# EAGLE design PropBoard_V1.7 (EAGLE 7.6.0)
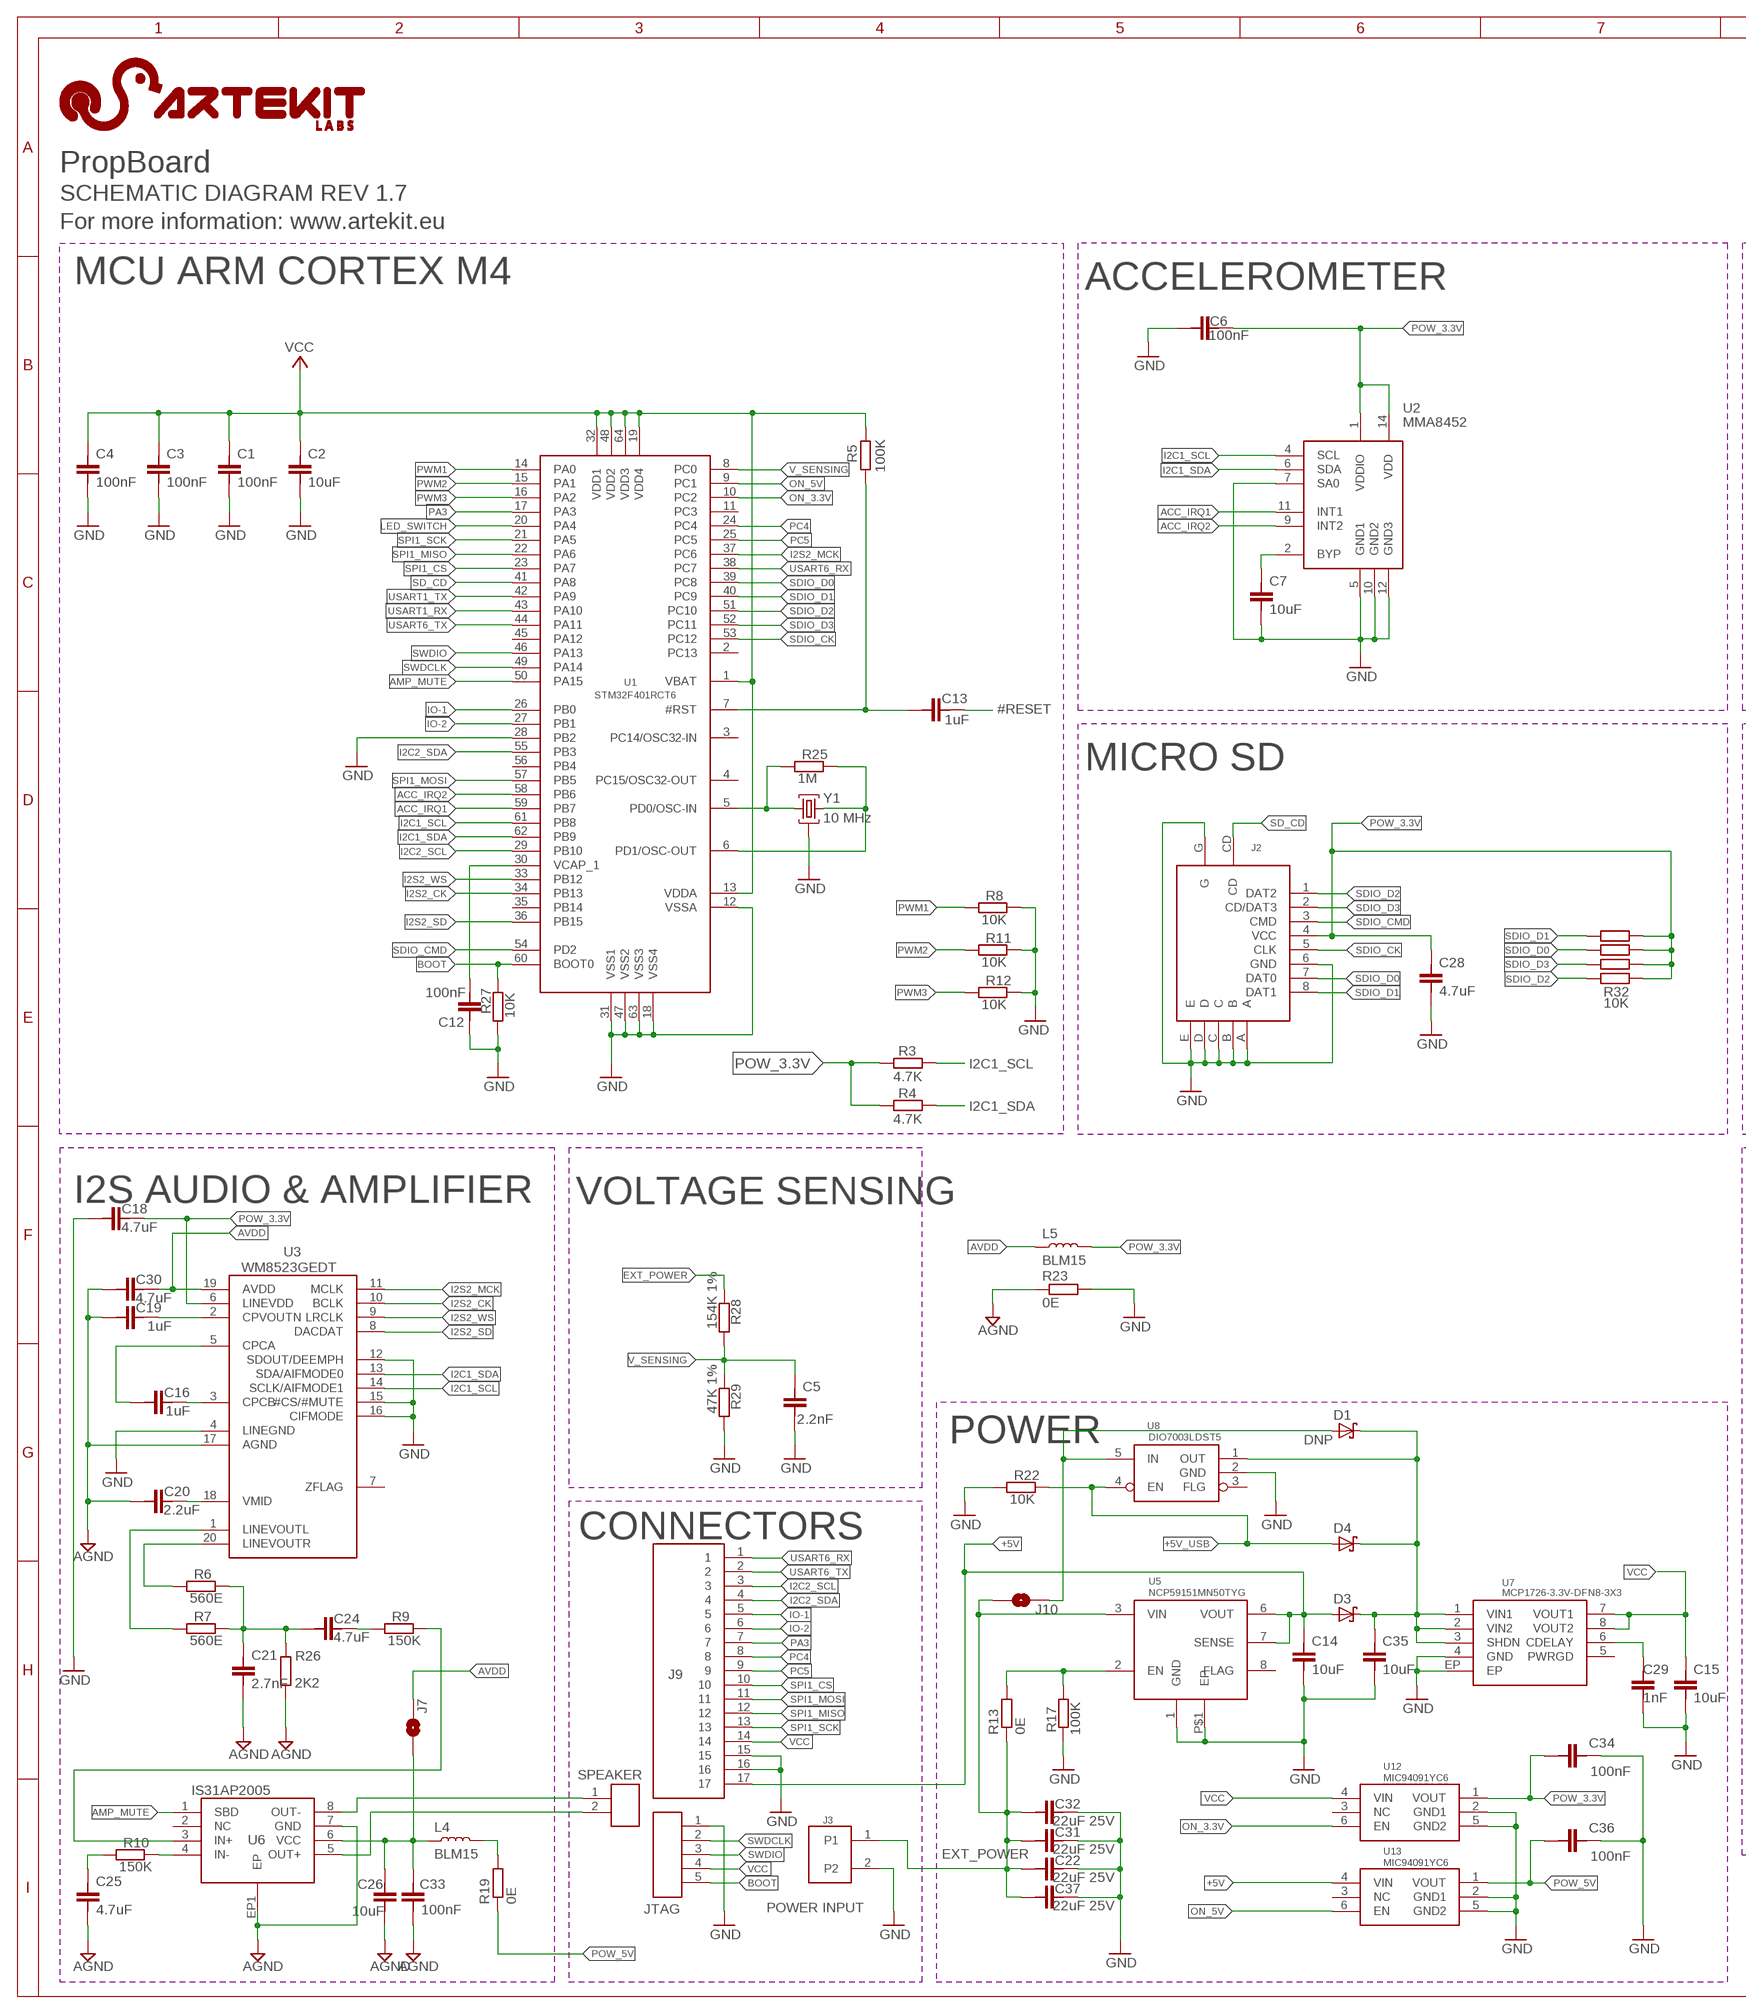
[diagram p0: schematic, sheet 1, part 1 of 2]
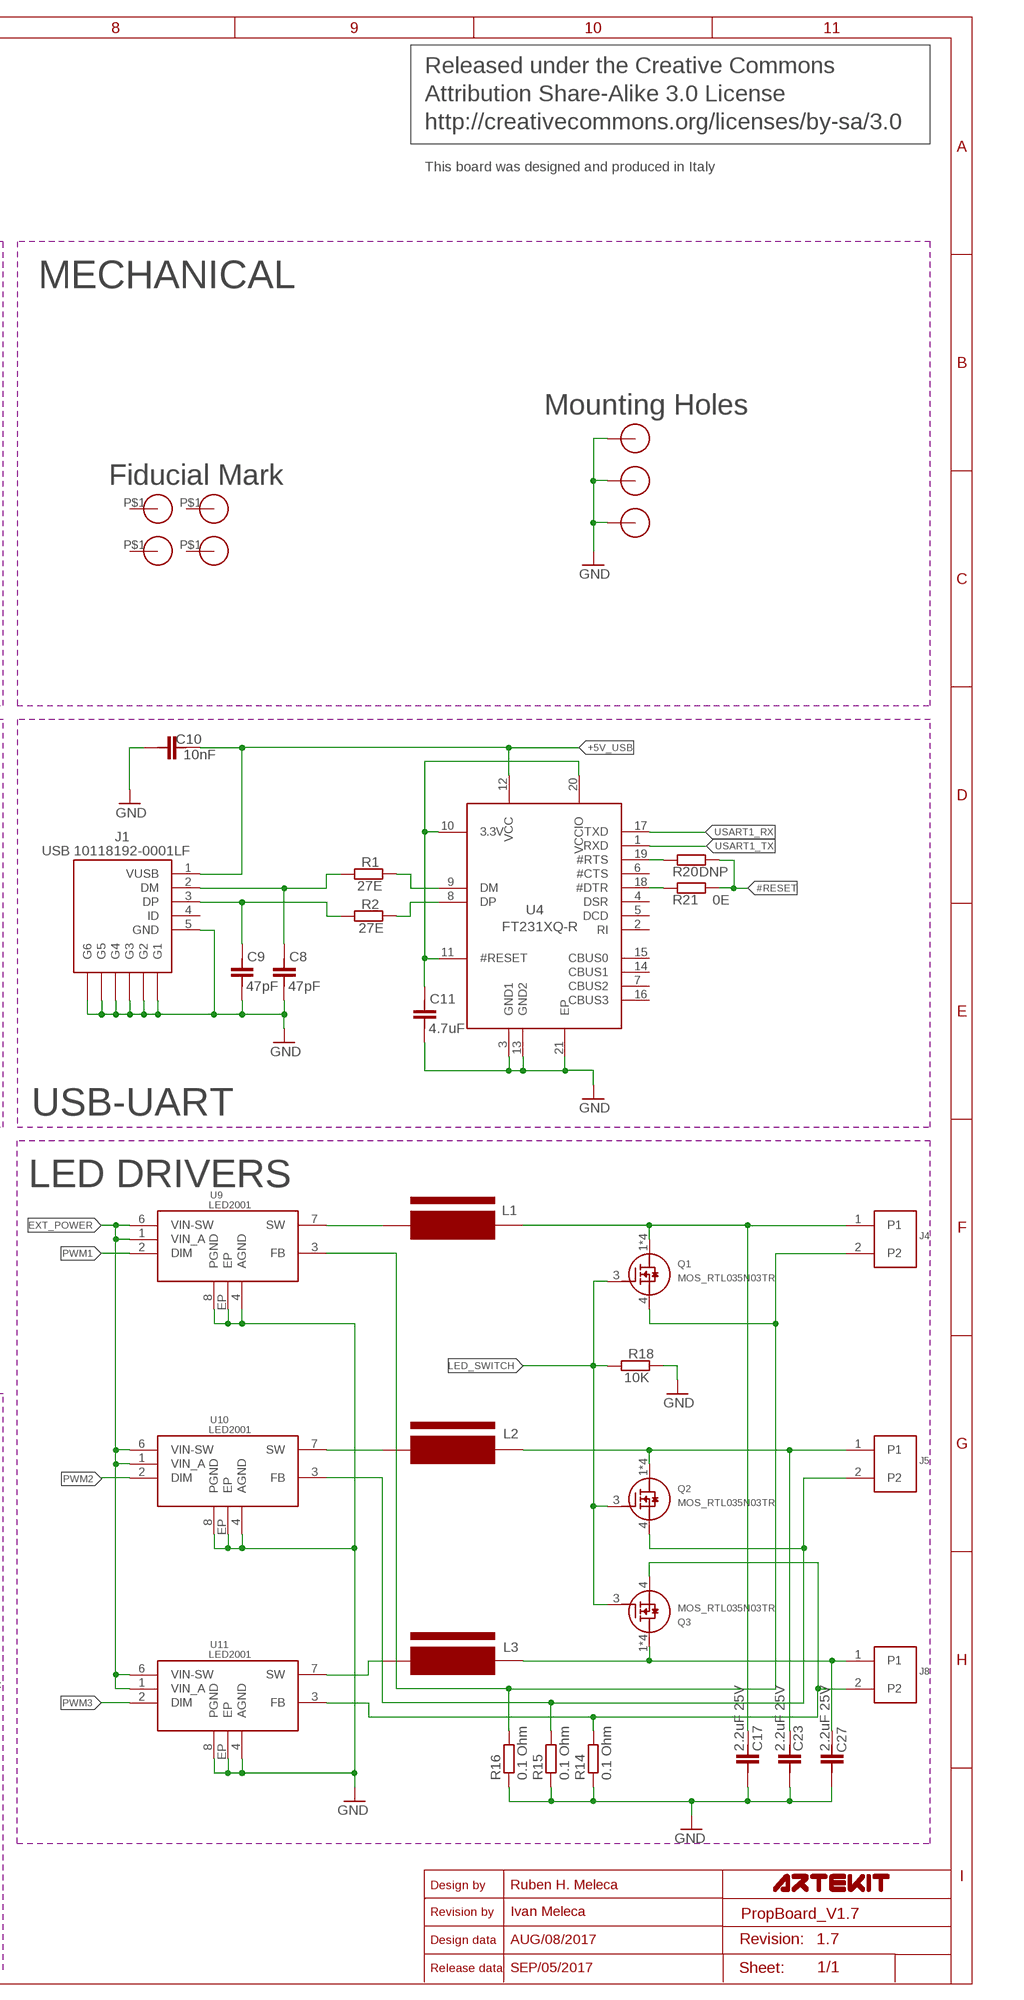
[diagram p1: schematic, sheet 1, part 2 of 2]

## Parts
C1  100nF  C0402  [C0402]
C2  10uF  C0402  [C0402]
C3  100nF  C0402  [C0402]
C4  100nF  C0402  [C0402]
C5  2.2nF  C0402  [C0402]
C6  100nF  C0402  [C0402]
C7  10uF  C0402  [C0402]
C8  47pF  C0402  [C0402]
C9  47pF  C0402  [C0402]
C10  10nF  C0402  [C0402]
C11  4.7uF  C0402  [C0402]
C12  100nF  C0402  [C0402]
C13  1uF  C0402  [C0402]
C14  10uF  C0402  [C0402]
C15  10uF  C0402  [C0402]
C16  1uF  C0402-WIDE  [C0402-WIDE]
C17  2.2uF 25V  C0603  [C0603]
C18  4.7uF  C0402  [C0402]
C19  1uF  C0402  [C0402]
C20  2.2uF  C0402  [C0402]
C21  2.7nF  C0402  [C0402]
C22  22uF 25V  C0805  [C0805]
C23  2.2uF 25V  C0603  [C0603]
C24  4.7uF  C0402  [C0402]
C25  4.7uF  C0402  [C0402]
C26  10uF  C0402  [C0402]
C27  2.2uF 25V  C0603  [C0603]
C28  4.7uF  C0402  [C0402]
C29  1nF  C0402  [C0402]
C30  4.7uF  C0402  [C0402]
C31  22uF 25V  C0805  [C0805]
C32  22uF 25V  C0805  [C0805]
C33  100nF  C0402  [C0402]
C34  100nF  C0402  [C0402]
C35  10uF  C0402  [C0402]
C36  100nF  C0402  [C0402]
C37  22uF 25V  C0805  [C0805]
D1  DNP  DIO-SCHOTTKY-10V-1A-BAT60JFILM  [SOD-323]
D3  BAT60  DIO-SCHOTTKY-10V-1A-BAT60JFILM  [SOD-323]
D4  BAT60  DIO-SCHOTTKY-10V-1A-BAT60JFILM  [SOD-323]
J1  USB 10118192-0001LF  CON-USB-MICRO-B-SMD  [CON-USB-MICRO-B-SMD]
J2  MICRO-SD-CON-MOLEX-503182-0852  [MICRO-SD-CON-MOLEX-503182-0852]
J3  PROP-POWER-PAD  [2-WAY-POWER-PAD]
J4  PROP-LED-PAD  [2-WAY-POWER-PAD-SMALL]
J5  PROP-LED-PAD  [2-WAY-POWER-PAD-SMALL]
J6  CON-PH-1X02-P0.1"2MM  [PIN-HEADER-1X02-P2MM]
J7  JUMPER-1-OPEN  [JUMPER-1-OPEN]
J8  PROP-LED-PAD  [2-WAY-POWER-PAD-SMALL]
J9  CON-PH-1X17-P0.1  [PIN-HEADER-1X17-NODASH]
J10  JUMPER-1-OPEN  [JUMPER-1-OPEN]
L1  SRN6028-3R9M  IND-MURATA-DG6050C-SERIES  [IND-MURATA-DG6050-SERIES]
L2  SRN6028-3R9M  IND-MURATA-DG6050C-SERIES  [IND-MURATA-DG6050-SERIES]
L3  SRN6028-3R9M  IND-MURATA-DG6050C-SERIES  [IND-MURATA-DG6050-SERIES]
L4  BLM15  L0402  [I0402]
L5  BLM15  L0402  [I0402]
Q1  MOS_RTL035N03TR  [SOT-363-6]
Q2  MOS_RTL035N03TR  [SOT-363-6]
Q3  MOS_RTL035N03TR  [SOT-363-6]
R1  27E  R0402  [R0402]
R2  27E  R0402  [R0402]
R3  4.7K  R0402  [R0402]
R4  4.7K  R0402  [R0402]
R5  100K  R0402  [R0402]
R6  560E  R0402  [R0402]
R7  560E  R0402  [R0402]
R8  10K  R0402  [R0402]
R9  150K  R0402  [R0402]
R10  150K  R0402  [R0402]
R11  10K  R0402  [R0402]
R12  10K  R0402  [R0402]
R13  0E  R0603  [R0603]
R14  0.1 Ohm  R0805  [R0805]
R15  0.1 Ohm  R0805  [R0805]
R16  0.1 Ohm  R0805  [R0805]
R17  100K  R0402  [R0402]
R18  10K  R0402  [R0402]
R19  0E  R0603  [R0603]
R20  DNP  R0402  [R0402]
R21  0E  R0402  [R0402]
R22  10K  R0402  [R0402]
R23  0E  R0402  [R0402]
R25  1M  R0402  [R0402]
R26  2K2  R0402  [R0402]
R27  10K  R0402  [R0402]
R28  154K 1%  R0402  [R0402]
R29  47K 1%  R0402  [R0402]
R32  10K  RESISTOR-ARRAY-X4-0603  [RES-ARRAY-0603]
U1  STM32F401RCT6  STM32F401RBT6  [LQFP64-10X10-P0.50]
U2  MMA8452  [QFN-COL-16-3X3-P0.50-MMA8452]
U3  WM8523GEDT  [TSSOP-20]
U4  FT231XQ-R  [QFN20-4X4-P0.50]
U5  NCP59151MN50TYG  [DFN8-4X4]
U6  IS31AP2005  IS31AP2005-DLS2-TR  [DFN-8-3X3MM-P0.65]
U7  MCP1726-3.3V-DFN8-3X3  [DFN8-3X3]
U8  DIO7003LDST5  [SOT23-5]
U9  LED2001  LED2001-VFQFPN8  [VFQFPN-8]
U10  LED2001  LED2001-VFQFPN8  [VFQFPN-8]
U11  LED2001  LED2001-VFQFPN8  [VFQFPN-8]
U12  MIC94091YC6  [SOT363-6]
U13  MIC94091YC6  [SOT363-6]
U$1  CON-PH-1X05-P0.1"  [PIN-HEADER-1X05-NODASH]
U$2  HOLE-2MM-METALIZED  [HOLE-2MM-METALIZED]
U$3  HOLE-2MM-METALIZED  [HOLE-2MM-METALIZED]
U$4  HOLE-2MM-METALIZED  [HOLE-2MM-METALIZED]
U$5  FIDUTIAL_1.2MM  [FIDUTIAL_1.2MM]
U$6  FIDUTIAL_1.2MM  [FIDUTIAL_1.2MM]
U$8  FIDUTIAL_1.2MM  [FIDUTIAL_1.2MM]
U$9  FIDUTIAL_1.2MM  [FIDUTIAL_1.2MM]
Y1  10 MHz  RESONATOR-MURATA-CSTCE8M00G55-R0  [RESONATOR-MURATA-CSTCE-SERIES]

## Nets
#RESET: C13.2 R20.1 R21.1
+5V: C14.1 D3.A J9.17 U5.6(VOUT) U5.7(SENSE) U13.4(VIN)
+5V_USB: C10.2 D4.A J1.1(VUSB) R22.2 U4.12(VCC) U8.4(EN)
ACC_IRQ1: U1.59(PB7) U2.11(INT1)
ACC_IRQ2: U1.58(PB6) U2.9(INT2)
AGND: C19.1 C20.1 C21.2 C25.2 C26.2 C30.1 C33.2 R23.1 R26.1 U3.17(AGND) U6.7(GND) U6.EP1(EP)
AMP_MUTE: U1.50(PA15) U6.1(SBD)
AVDD: C30.2 J7.2 L5.1 U3.19(AVDD)
BOOT: R27.2 U1.60(BOOT0) U$1.5
EXT_POWER: C22.1 C31.1 C32.1 C37.1 J3.1 J10.1 R13.1 R28.2 U5.3(VIN) U9.1(VIN_A) U9.6(VIN-SW) U10.1(VIN_A) U10.6(VIN-SW) U11.1(VIN_A) U11.6(VIN-SW)
GND: C1.2 C2.2 C3.2 C4.2 C5.2 C6.1 C7.2 C8.1 C9.1 C10.1 C11.1 C12.2 C14.2 C15.2 C17.2 C18.1 C22.2 C23.2 C27.2 C28.2 C29.2 C31.2 C32.2 C34.2 C35.2 C36.2 C37.2 J1.5(GND) J1.6(G1) J1.7(G2) J1.8(G3) J1.9(G4) J1.10(G5) J1.11(G6) J2.6(GND) J2.A J2.B J2.C J2.D J2.E J2.G J3.2 J9.15 J9.16 R8.2 R11.2 R12.2 R14.1 R15.1 R16.1 R17.2 R18.2 R22.1 R23.2 R27.1 R29.1 U1.12(VSSA) U1.18(VSS4) U1.28(PB2) U1.31(VSS1) U1.47(VSS2) U1.63(VSS3) U2.5(GND1) U2.7(SA0) U2.10(GND2) U2.12(GND3) U3.4(LINEGND) U3.12(SDOUT/DEEMPH) U3.15(#CS/#MUTE) U3.16(CIFMODE) U4.3(GND1) U4.13(GND2) U4.21(EP) U5.1(GND) U5.P$1(EP) U7.4(GND) U7.EP U8.2(GND) U9.4(AGND) U9.8(PGND) U9.EP U10.4(AGND) U10.8(PGND) U10.EP U11.4(AGND) U11.8(PGND) U11.EP U12.2(GND1) U12.5(GND2) U13.2(GND1) U13.5(GND2) U$1.1 U$2.1 U$3.1 U$4.1 Y1.2
I2C1_SCL: R3.1 U1.61(PB8) U2.4(SCL) U3.14(SCLK/AIFMODE1)
I2C1_SDA: R4.1 U1.62(PB9) U2.6(SDA) U3.13(SDA/AIFMODE0)
I2C2_SCL: J9.3 U1.29(PB10)
I2C2_SDA: J9.4 U1.55(PB3)
I2S2_CK: U1.34(PB13) U3.10(BCLK)
I2S2_MCK: U1.37(PC6) U3.11(MCLK)
I2S2_SD: U1.36(PB15) U3.8(DACDAT)
I2S2_WS: U1.33(PB12) U3.9(LRCLK)
IO-1: J9.5 U1.26(PB0)
IO-2: J9.6 U1.27(PB1)
LED_SWITCH: Q1.3(G) Q2.3(G) Q3.3(G) R18.1 U1.20(PA4)
N$1: R1.2 U4.9(DM)
N$2: R2.2 U4.8(DP)
N$3: C8.2 J1.2(DM) R1.1
N$4: C9.2 J1.3(DP) R2.1
N$5: R10.2 U6.4(IN-)
N$6: C11.2 U4.10(3.3V) U4.11(#RESET) U4.20(VCCIO)
N$7: C7.1 U2.2(BYP)
N$8: L1.1 U9.7(SW)
N$9: C13.1 R5.1 U1.7(#RST)
N$10: R25.1 U1.5(PD0/OSC-IN) Y1.1
N$11: R25.2 U1.6(PD1/OSC-OUT) Y1.3
N$12: C16.2 U3.3(CPCB)
N$13: C17.1 J4.1 L1.2 Q1.1(D) Q1.2(D) Q1.5(D) Q1.6(D)
N$14: C16.1 U3.5(CPCA)
N$15: C19.2 U3.2(CPVOUTN)
N$16: J4.2 Q1.4(S) R16.2 U9.3(FB)
N$17: C20.2 U3.18(VMID)
N$18: R6.1 U3.20(LINEVOUTR)
N$19: R7.1 U3.1(LINEVOUTL)
N$20: R20.2 U4.19(#RTS)
N$21: C21.1 C24.1 R6.2 R7.2 R26.2
N$22: R21.2 U4.18(#DTR)
N$23: C24.2 R9.1
N$24: R9.2 U6.3(IN+)
N$25: L4.2 R19.2
N$26: C25.1 R10.1
N$27: J6.1 U6.8(OUT-)
N$28: J8.2 Q3.4(S) R14.2 U11.3(FB)
N$29: C26.1 C33.1 J7.1 L4.1 U6.6(VCC)
N$30: J5.2 Q2.4(S) R15.2 U10.3(FB)
N$31: C35.1 D1.C D3.C D4.C U7.1(VIN1) U7.2(VIN2) U7.3(SHDN) U8.1(OUT)
N$32: R13.2 R17.1 U5.2(EN)
N$33: C23.1 J5.1 L2.2 Q2.1(D) Q2.2(D) Q2.5(D) Q2.6(D)
N$34: C27.1 J8.1 L3.2 Q3.1(D) Q3.2(D) Q3.5(D) Q3.6(D)
N$35: L2.1 U10.7(SW)
N$36: L3.1 U11.7(SW)
N$37: J6.2 U6.5(OUT+)
N$38: D1.A J10.2 U8.5(IN)
N$41: C29.1 U7.6(CDELAY)
N$42: C12.1 U1.30(VCAP_1)
ON_3.3V: U1.10(PC2) U12.6(EN)
ON_5V: U1.9(PC1) U13.6(EN)
PA3: J9.7 U1.17(PA3)
PC4: J9.8 U1.24(PC4)
PC5: J9.9 U1.25(PC5)
POW_3.3V: C6.2 C18.2 C28.1 C34.1 J2.4(VCC) L5.2 R3.2 R4.2 R32.2 R32.4 R32.6 R32.8 U2.1(VDDIO) U2.14(VDD) U3.6(LINEVDD) U12.1(VOUT)
POW_5V: C36.1 R19.1 U13.1(VOUT)
PWM1: R8.1 U1.14(PA0) U9.2(DIM)
PWM2: R11.1 U1.15(PA1) U10.2(DIM)
PWM3: R12.1 U1.16(PA2) U11.2(DIM)
SD_CD: J2.CD U1.41(PA8)
SDIO_CK: J2.5(CLK) U1.53(PC12)
SDIO_CMD: J2.3(CMD) U1.54(PD2)
SDIO_D0: J2.7(DAT0) R32.3 U1.39(PC8)
SDIO_D1: J2.8(DAT1) R32.1 U1.40(PC9)
SDIO_D2: J2.1(DAT2) R32.7 U1.51(PC10)
SDIO_D3: J2.2(CD/DAT3) R32.5 U1.52(PC11)
SPI1_CS: J9.10 U1.23(PA7)
SPI1_MISO: J9.12 U1.22(PA6)
SPI1_MOSI: J9.11 U1.57(PB5)
SPI1_SCK: J9.13 U1.21(PA5)
SWDCLK: U1.49(PA14) U$1.2
SWDIO: U1.46(PA13) U$1.3
USART1_RX: U1.43(PA10) U4.17(TXD)
USART1_TX: U1.42(PA9) U4.1(RXD)
USART6_RX: J9.1 U1.38(PC7)
USART6_TX: J9.2 U1.44(PA11)
V_SENSING: C5.1 R28.1 R29.2 U1.8(PC0)
VCC: C1.1 C2.1 C3.1 C4.1 C15.1 J9.14 R5.2 U1.1(VBAT) U1.13(VDDA) U1.19(VDD4) U1.32(VDD1) U1.48(VDD2) U1.64(VDD3) U7.7(VOUT1) U7.8(VOUT2) U12.4(VIN) U$1.4
Unconnected: J1.4(ID) U1.2(PC13) U1.3(PC14/OSC32-IN) U1.4(PC15/OSC32-OUT) U1.11(PC3) U1.35(PB14) U1.45(PA12) U1.56(PB4) U3.7(ZFLAG) U4.2(RI) U4.4(DSR) U4.5(DCD) U4.6(#CTS) U4.7(CBUS2) U4.14(CBUS1) U4.15(CBUS0) U4.16(CBUS3) U5.8(FLAG) U6.2(NC) U7.5(PWRGD) U8.3(FLG) U12.3(NC) U13.3(NC) U$5.P$1 U$6.P$1 U$8.P$1 U$9.P$1

## Notes on the sheet
- Released under the Creative Commons
- Attribution Share-Alike 3.0 License
- http://creativecommons.org/licenses/by-sa/3.0
- PropBoard | This board was designed and produced in Italy
- SCHEMATIC DIAGRAM REV 1.7
- For more information: www.artekit.eu
- MCU ARM CORTEX M4 | ACCELEROMETER | MECHANICAL
- Mounting Holes
- Fiducial Mark
- MICRO SD
- USB-UART
- I2S AUDIO & AMPLIFIER | VOLTAGE SENSING | LED DRIVERS
- POWER | DNP
- CONNECTORS
- SPEAKER
- JTAG | POWER INPUT | Design by | Ruben H. Meleca
- Revision by | Ivan Meleca
- Design data | AUG/08/2017 | Revision: | 1.7
- Release data | SEP/05/2017 | Sheet:

## Library data of the parts
C1-C15 C18-C21 C24-C26 C28-C30 C33-C36 = ak:C0402: CAP SMD 0402 NP; MF: unknown; MPN: unknown
C16 = ak:C0402-WIDE
C17 C23 C27 = artekit:C0603: CAP SMD 0603 NP; MF: unknown; MPN: unknown
C22 C31 C32 C37 = artekit:C0805: CAP SMD 0805 NP; MF: unknown; MPN: unknown
D1 D3 D4 = artekit:DIO-SCHOTTKY-10V-1A-BAT60JFILM: Schottky Diodes & Rectifiers 3.0 Amp 10 Volt; MF: ST Microelectronics; MPN: BAT60JFILM; OC_DIGIKEY: 497-3707-1-ND; OC_FARNEL: 1467544; OC_MOUSER: 511-BAT60JFILM
J1 = ak:CON-USB-MICRO-B-SMD: USB-MICRO SMD Connector; MF: FCI; MPN: 10118192-0001LF; OC_DIGIKEY: 609-4613-1-ND; OC_FARNELL: 2506568; OC_MOUSER: 649-10118192-0001LF
J2 = artekit:MICRO-SD-CON-MOLEX-503182-0852: MicroSD connector Molex 503182-0852; MF: Molex; MPN: 503182-1852; OC_MOUSER: 538-503182-1852
J3 = artekit:PROP-POWER-PAD
J4 J5 J8 = artekit:PROP-LED-PAD
J6 = ak:CON-PH-1X02-P0.1"
J7 J10 = artekit:JUMPER-1-OPEN
J9 = ak:CON-PH-1X17-P0.1
L1 = artekit:IND-MURATA-DG6050C-SERIES: Inductor Murata DG6050C Series; MF: Bourns; MPN: SRN6028-3R9M; OC_MOUSER: 652-SRN6028-3R9M
L2 L3 = artekit:IND-MURATA-DG6050C-SERIES: Inductor Murata DG6050C Series; MF: Murata; MPN: SRN6028-3R9M; OC_MOUSER: 652-SRN6028-3R9M
L4 L5 = artekit:L0402: Generic inductor SMT 0492; MF: Murata; MPN: BLM15AG102SN1
Q1-Q3 = artekit:MOS_RTL035N03TR: N-Channel MOSFET 3.5A 30V SOT363-6; MF: ROHM Semiconductor; MPN: RTL035N03TR; OC_MOUSER: 755-RTL035N03TR
R1-R5 R8 R11 R12 R17 R18 R20-R22 R25 R27-R29 = ak:R0402: RES SMD 0402; MF: unknown; MPN: unknown
R6 R7 R9 R10 R26 = artekit:R0402: RES SMD 0402; MF: unknown; MPN: unknown
R13 R19 = artekit:R0603: RES SMD 0603; MF: unknown; MPN: unknown
R14-R16 = artekit:R0805: RES SMD 0805; MF: unknown; MPN: unknown
R23 = artekit:R0402: RES SMD 0402; MF: Murata; MPN: BLM15AG102SN1
R32 = artekit:RESISTOR-ARRAY-X4-0603: Resistor Array X4 0603
U1 = ak:STM32F401RBT6: ARM Cortex M4 STM32F401RBT6 LFP64; MF: ST Microelectronics; MPN: STM32F401RCT6; OC_MOUSER: 511-STM32F401RCT6
U2 = ak:MMA8452: Accelerometes LOW G 3-AXIS 12BT EX VLT; MF: NXP; MPN: MMA8452QT; OC_DIGIKEY: MMA8452QR1CT-ND; OC_FARNELL: 1842360; OC_MOUSER: 841-MMA8452QT
U3 = ak:WM8523GEDT: Audio D/A Converter ICs STEREO DAC; MF: Cirrus Logic; MPN: WM8523GEDT; OC_DIGIKEY: WM8523GEDT/RCT-ND; OC_MOUSER: 238-WM8523GEDT
U4 = ak:FT231XQ-R: FT231XQ-R - USB to UART Bridge; MF: FTDI; MPN: FT231XQ-R; OC_MOUSER: 895-FT231XQ-R
U5 = artekit:NCP59151MN50TYG: 5V 1.5 A, Very Low-Dropout(VLDO) Fast TransientResponse Regulator Series; MF: ON Semiconductors; MPN: NCP59151MN50TYG; OC_DIGIKEY: NCP59151MN50TYGOSTR-ND; OC_MOUSER: 863-NCP59151MN50TYG
U6 = ak:IS31AP2005-DLS2-TR: Class-D 2.7W Audio Amplifier; MF: ISSI; MPN: IS31AP2005-DLS2-TR; OC_DIGIKEY: 706-1169-1-ND; OC_MOUSER: 870-31AP2005DLS2TR
U7 = artekit:MCP1726-3.3V-DFN8-3X3: 1A 3.3V Low Quiescent Current LDO Regulator; MF: Microchip; MPN: MCP1726T-3302E/MF; OC_DIGIKEY: MCP1726T-3302E/MF-ND; OC_FARNELL: 1851970; OC_MOUSER: 579-MCP1726T3302E/MF
U8 = ak:DIO7003LDST5: Power Switch 5.5V 1.5A; MF: DIOO Microcircuits; MPN: DIO7003LDST5; OC_MOUSER: 453-DIO7003LDST5
U9-U11 = artekit:LED2001-VFQFPN8: 4 A monolithic step-down current source with synchronous rectification; MF: ST Microelectronics; MPN: LED2001PUR; OC_DIGIKEY: 497-13853-1-ND; OC_FARNELL: 2460827; OC_MOUSER: 511-LED2001PUR
U12 U13 = ak:MIC94091YC6: Load Switch 5.5V with load discharge. 1.5A; MF: Microchip Technology/Micrel; MPN: MIC94091YC6-TR; OC_MOUSER: 998-MIC94091YC6TR
U$1 = ak:CON-PH-1X05-P0.1"
U$2-U$4 = artekit:HOLE-2MM-METALIZED: Metalized hole 2mm
U$5 U$6 U$8 U$9 = artekit:FIDUTIAL_1.2MM
Y1 = ak:RESONATOR-MURATA-CSTCE8M00G55-R0: Resonator 8MHz 0.5%; MF: Murata; MPN: CSTCE8M00G55-R0; OC_DIGIKEY: 490-1195-1-ND; OC_FARNELL: 2443270; OC_MOUSER: 81-CSTCE8M00G55-R0

## Board
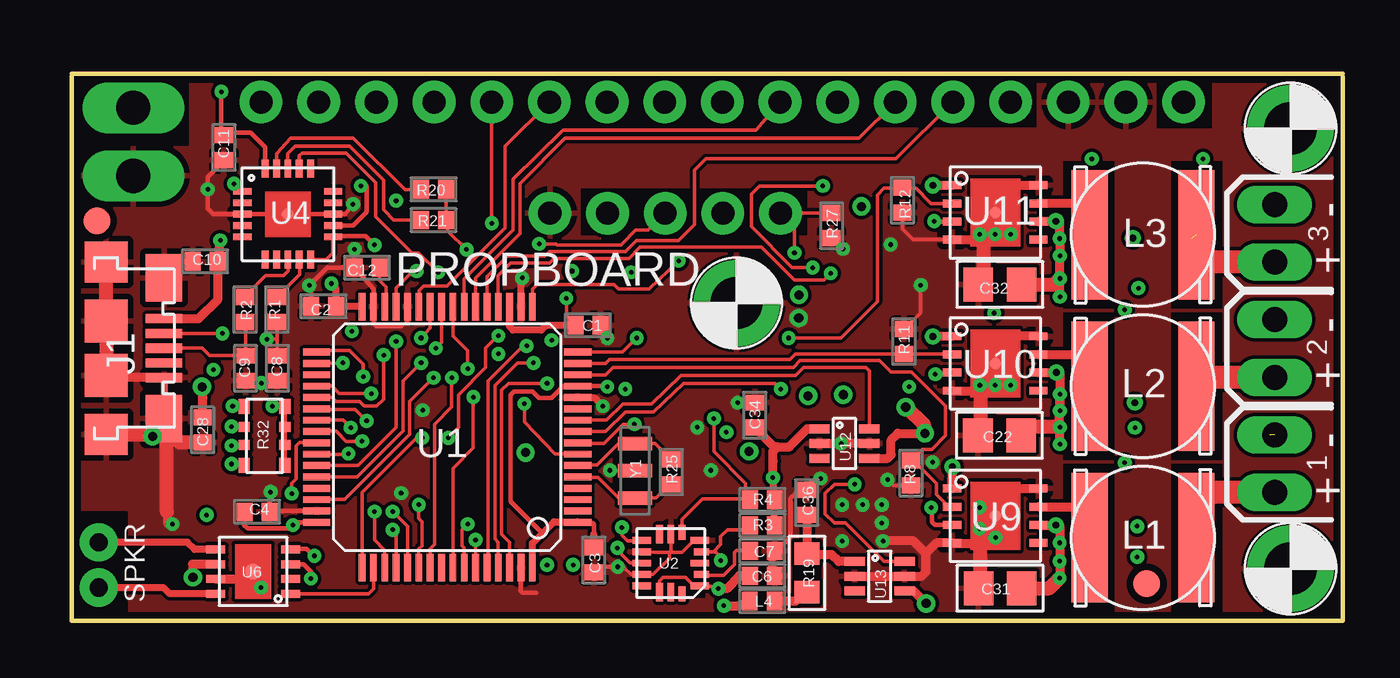
[diagram p2: board, top side]
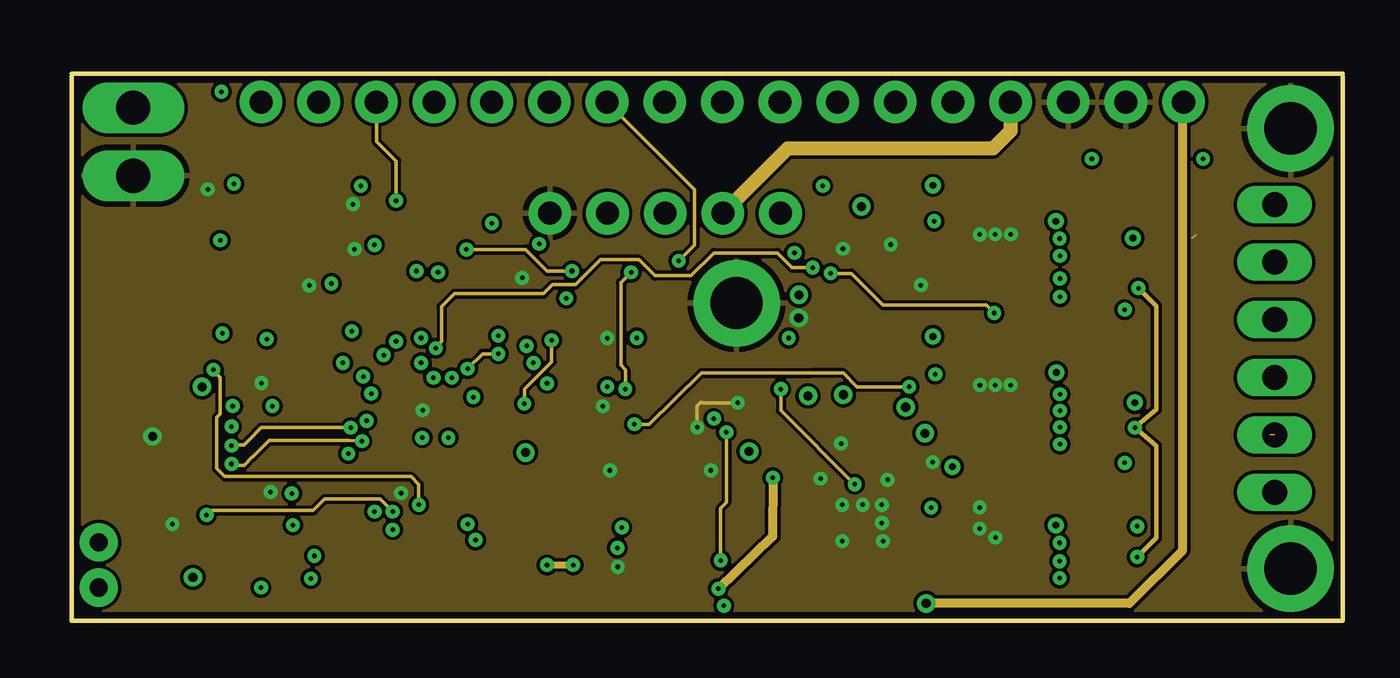
[diagram p3: board, inner layer GND]
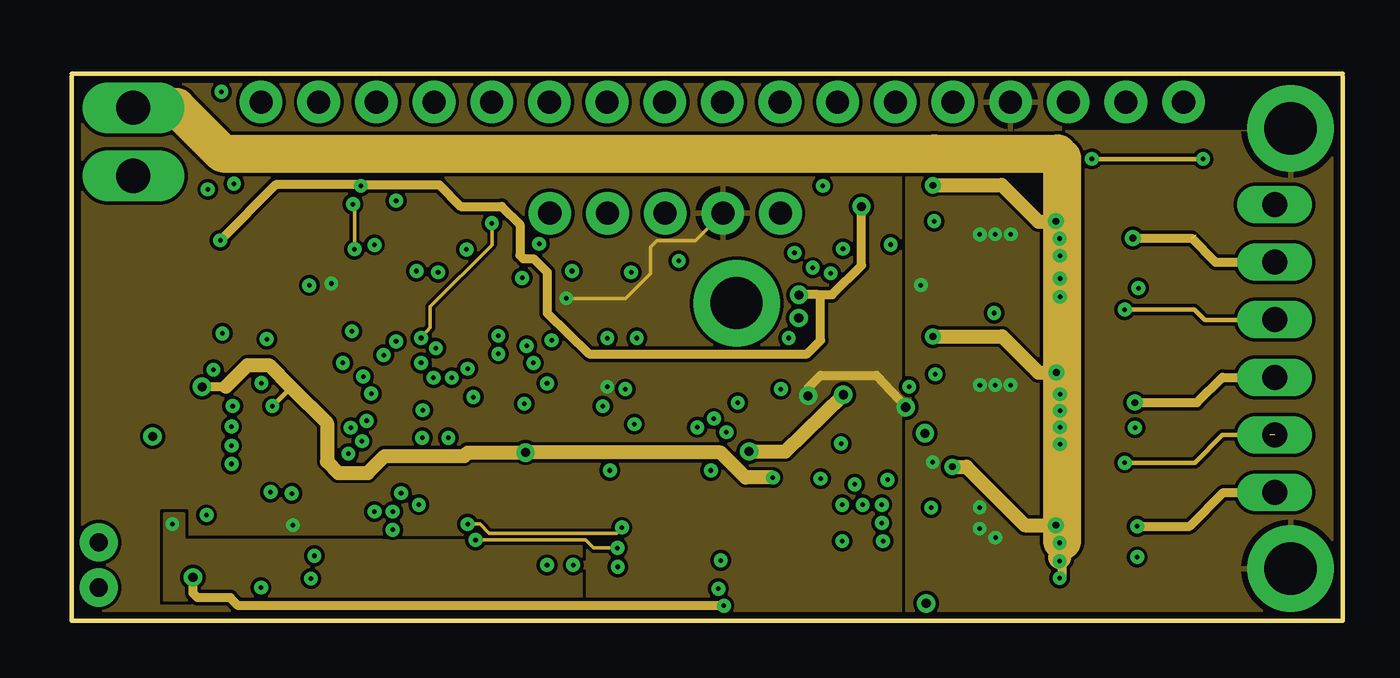
[diagram p4: board, inner layer VCC]
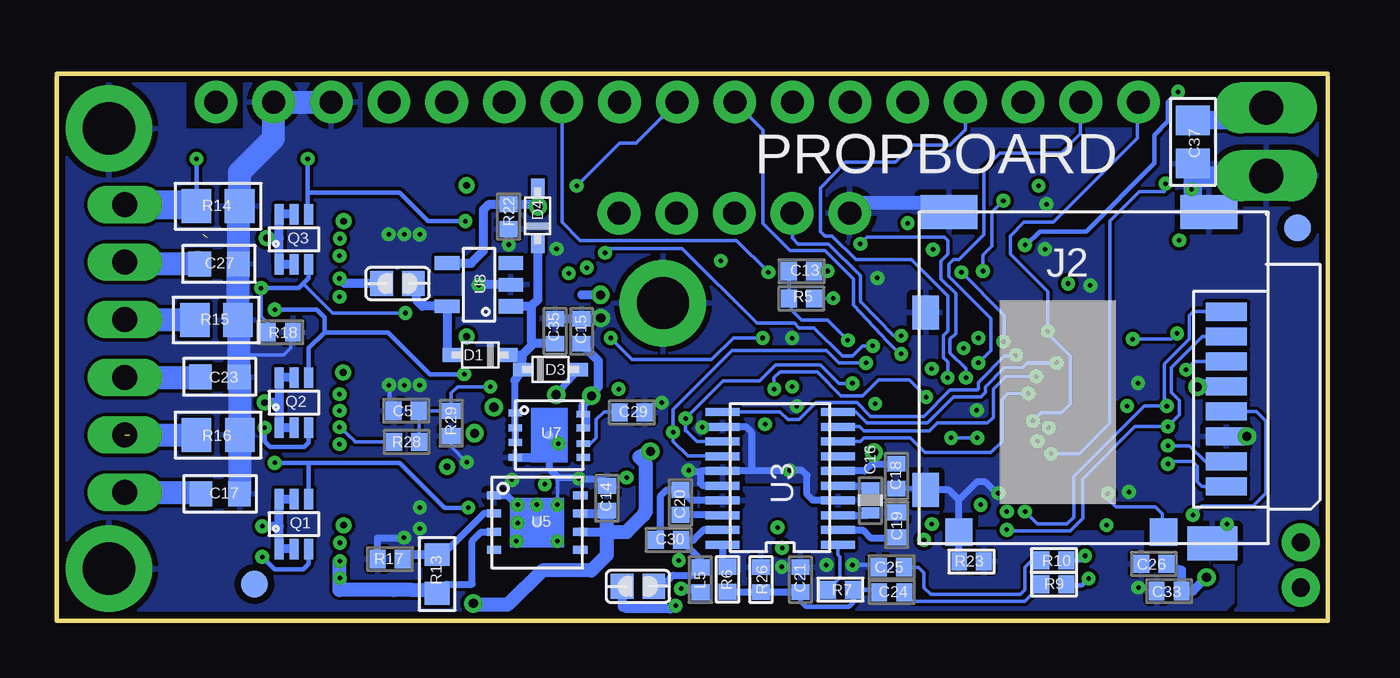
[diagram p5: board, bottom side, seen from below]

Size 56 x 24.11 mm. Coordinates in mm from the lower left corner, seen from the top.
Outline: 56,24 56,0 0,0 0,24
Outline: 0,24.11 56,24.11
Copper layers (1*16): Top 0.035mm / dielectric 1.5mm / Bottom 0.035mm
Design rules "artekit": minimum track width 0.15mm, minimum drill 0.2mm, track to track 0.15mm, track to pad 0.15mm, pad to pad 0.2mm, via to via 0.15mm, smd to smd 0mil, copper to edge 0.3mm, drill to drill 8mil, minimum pad ring 10mil, minimum via ring 8mil, stop-mask expansion 4mil, vias tented up to drill 20mil, thermal gap 10mil
tRestrict: area 47.8,21.7 to 50.2,24; area 0.1,20.9 to 5.2,23.9; area 0.1,0.2 to 2.5,4.8; area 22.5,17 to 32.4,19.1; area 7.2,21.8 to 42.5,23.9; area 7.6,16 to 11.4,19.9; area 23.9,5.9 to 25.8,7.2; area 24.9,1 to 27.9,4
bRestrict: area 22.5,17 to 32.4,19.1; area 47.8,21.7 to 50.3,23.9; area 6.2,3.1 to 8.1,4.7; area 7.2,21.8 to 42.5,23.9; area 19.6,5.1 to 20.7,5.6; area 36.5,11.3 to 38.2,12.1

### Footprints (pad centres in the part's own frame; a part is rotated, then mirrored left to right if it is on the bottom)
C0402 = smd 0.7 x 0.8: 1 -0.55,0; 2 0.55,0
C0402-WIDE = smd 0.5 x 0.8: 1 -0.55,0; 2 0.55,0
C0603 = smd 1 x 1.1: 1 -0.85,0; 2 0.85,0
C0805 = smd 1.3 x 1.5: 1 -0.99,0; 2 0.91,0
SOD-323 = smd 0.8 x 0.6: A 1.25,0; C -1.25,0
CON-USB-MICRO-B-SMD = smd 0.4 x 1.6: 1 -1.3,2.55; 2 -0.65,2.55; 3 0,2.55; 4 0.65,2.55; 5 1.3,2.55 | smd 2.1 x 1.6: 6 3.1,2.55; 11 -3.1,2.55 | smd 1.8 x 1.9: 7 3.8,0; 10 -3.8,0 | smd 1.9 x 1.9: 8 1.2,0; 9 -1.2,0
MICRO-SD-CON-MOLEX-503182-0852 = smd 0.8 x 1.8: 1 -3.31,6.15; 2 -2.21,6.15; 3 -1.11,6.15; 4 -0.01,6.15; 5 1.09,6.15; 6 2.19,6.15; 7 3.29,6.15; 8 4.39,6.15 | smd 1.5 x 2.5: A -7.7,5.37; B -7.7,-6.08 | smd 1.5 x 1.15: C -3.27,-7.1; D 4.55,-7.1 | smd 1.2 x 1.2: CD 6.4,3.38; G 6.4,-5.64 | smd 1.5 x 2.2: E 6.9,5.53
2-WAY-POWER-PAD = drill 1.5 long: 1 0,0; 2 3,0
2-WAY-POWER-PAD-SMALL = drill 1.1 long: 1 0,0; 2 2.54,0
PIN-HEADER-1X02-P2MM = drill 0.8 pad 1.676: 1 0,0; 2 2,0
JUMPER-1-OPEN = smd 1 x 1.1: 1 -0.7,0; 2 0.7,0
PIN-HEADER-1X17-NODASH = drill 1.016 pad 1.88: 1 0,0; 2 2.54,0; 3 5.08,0; 4 7.62,0; 5 10.16,0; 6 12.7,0; 7 15.24,0; 8 17.78,0; 9 20.32,0; 10 22.86,0; 11 25.4,0; 12 27.94,0; 13 30.48,0; 14 33.02,0; 15 35.56,0; 16 38.1,0; 17 40.64,0
IND-MURATA-DG6050-SERIES = smd 1.6 x 5.7: 1 -2.35,0; 2 2.35,0
I0402 = smd 0.7 x 0.8: 1 -0.55,0; 2 0.55,0
SOT-363-6 = smd 0.4 x 0.9: 1 -0.65,-1.1; 2 0,-1.1; 3 0.65,-1.1; 4 0.65,1.1; 5 0,1.1; 6 -0.65,1.1
R0402 = smd 0.7 x 0.8: 1 -0.55,0; 2 0.55,0
R0603 = smd 1 x 1.1: 1 -0.85,0; 2 0.85,0
R0805 = smd 1.3 x 1.5: 1 -0.95,0; 2 0.95,0
RES-ARRAY-0603 = smd 0.65 x 0.5: 1 -1.3,0.9; 2 -1.3,-0.9; 7 1.3,0.9; 8 1.3,-0.9 | smd 0.45 x 0.5: 3 -0.4,0.9; 4 -0.4,-0.9; 5 0.4,0.9; 6 0.4,-0.9
LQFP64-10X10-P0.50 = smd 1.2 x 0.3: 1 -5.75,3.75; 2 -5.75,3.25; 3 -5.75,2.75; 4 -5.75,2.25; 5 -5.75,1.75; 6 -5.75,1.25; 7 -5.75,0.75; 8 -5.75,0.25; 9 -5.75,-0.25; 10 -5.75,-0.75; 11 -5.75,-1.25; 12 -5.75,-1.75; 13 -5.75,-2.25; 14 -5.75,-2.75; 15 -5.75,-3.25; 16 -5.75,-3.75; 33 5.75,-3.75; 34 5.75,-3.25; 35 5.75,-2.75; 36 5.75,-2.25; 37 5.75,-1.75; 38 5.75,-1.25; 39 5.75,-0.75; 40 5.75,-0.25; 41 5.75,0.25; 42 5.75,0.75; 43 5.75,1.25; 44 5.75,1.75; 45 5.75,2.25; 46 5.75,2.75; 47 5.75,3.25; 48 5.75,3.75 | smd 0.3 x 1.2: 17 -3.75,-5.75; 18 -3.25,-5.75; 19 -2.75,-5.75; 20 -2.25,-5.75; 21 -1.75,-5.75; 22 -1.25,-5.75; 23 -0.75,-5.75; 24 -0.25,-5.75; 25 0.25,-5.75; 26 0.75,-5.75; 27 1.25,-5.75; 28 1.75,-5.75; 29 2.25,-5.75; 30 2.75,-5.75; 31 3.25,-5.75; 32 3.75,-5.75; 49 3.75,5.75; 50 3.25,5.75; 51 2.75,5.75; 52 2.25,5.75; 53 1.75,5.75; 54 1.25,5.75; 55 0.75,5.75; 56 0.25,5.75; 57 -0.25,5.75; 58 -0.75,5.75; 59 -1.25,5.75; 60 -1.75,5.75; 61 -2.25,5.75; 62 -2.75,5.75; 63 -3.25,5.75; 64 -3.75,5.75
QFN-COL-16-3X3-P0.50-MMA8452 = smd 0.813 x 0.3: 1 -1.275,1; 3 -1.275,0; 5 -1.275,-1; 9 1.275,-1; 10 1.275,-0.5; 11 1.275,0; 12 1.275,0.5; 13 1.275,1 | smd 0.65 x 0.3: 2 -1.35,0.5; 4 -1.35,-0.5 | smd 0.3 x 0.65: 6 -0.5,-1.35; 16 -0.5,1.35 | smd 0.3 x 0.813: 7 0,-1.275; 8 0.5,-1.275; 14 0.5,1.275; 15 0,1.275
TSSOP-20 = smd 1.5 x 0.35: 1 -2.44,2.975; 2 -2.44,2.325; 3 -2.44,1.675; 4 -2.44,1.025; 5 -2.44,0.375; 6 -2.44,-0.275; 7 -2.44,-0.925; 8 -2.44,-1.575; 9 -2.44,-2.225; 10 -2.44,-2.875; 11 2.64,-2.875; 12 2.64,-2.225; 13 2.64,-1.575; 14 2.64,-0.925; 15 2.64,-0.275; 16 2.64,0.375; 17 2.64,1.025; 18 2.64,1.675; 19 2.64,2.325; 20 2.64,2.975
QFN20-4X4-P0.50 = smd 0.8 x 0.3: 1 -2,1; 2 -2,0.5; 3 -2,0; 4 -2,-0.5; 5 -2,-1; 11 2,-1; 12 2,-0.5; 13 2,0; 14 2,0.5; 15 2,1 | smd 0.3 x 0.8: 6 -1,-2; 7 -0.5,-2; 8 0,-2; 9 0.5,-2; 10 1,-2; 16 1,2; 17 0.5,2; 18 0,2; 19 -0.5,2; 20 -1,2 | smd 0.5 x 0.5: 21 0,0
DFN8-4X4 = smd 0.63 x 0.35: 1 -1.9,1.2; 2 -1.9,0.4; 3 -1.9,-0.4; 4 -1.9,-1.2; 5 1.9,-1.2; 6 1.9,-0.4; 7 1.9,0.4; 8 1.9,1.2 | smd 0.5 x 0.5: P$1 0,0
DFN-8-3X3MM-P0.65 = smd 0.35 x 0.85: 1 -0.975,-1.65; 2 -0.325,-1.65; 3 0.325,-1.65; 4 0.975,-1.65; 5 0.975,1.65; 6 0.325,1.65; 7 -0.325,1.65; 8 -0.975,1.65 | smd 0.7 x 0.7: EP1 0,0
DFN8-3X3 = smd 0.6 x 0.3: 1 -1.5,0.975; 2 -1.5,0.325; 3 -1.5,-0.325; 4 -1.5,-0.975; 5 1.5,-0.975; 6 1.5,-0.375; 7 1.5,0.325; 8 1.5,0.925 | smd 0.4 x 0.4: EP 0,0
SOT23-5 = smd 0.635 x 1.1: 1 -0.95,-1.4 | smd 0.6 x 1.1: 2 0,-1.4; 3 0.95,-1.4; 4 0.95,1.4; 5 -0.95,1.4
VFQFPN-8 = smd 0.8 x 0.35: 1 -1.9,1.2; 2 -1.9,0.4; 3 -1.9,-0.4; 4 -1.9,-1.2; 5 1.9,-1.2; 6 1.9,-0.4; 7 1.9,0.4; 8 1.9,1.2 | smd 0.5 x 0.5: EP 0,0
SOT363-6 = smd 0.4 x 0.9: 1 -0.65,-1.1; 2 0,-1.1; 3 0.65,-1.1; 4 0.65,1.1; 5 0,1.1; 6 -0.65,1.1
PIN-HEADER-1X05-NODASH = drill 1.016 pad 1.88: 1 0,0; 2 2.54,0; 3 5.08,0; 4 7.62,0; 5 10.16,0
HOLE-2MM-METALIZED = drill 2.3 pad 3.81: 1 0,0
FIDUTIAL_1.2MM = smd 1.2 x 1.2: P$1 0,0
RESONATOR-MURATA-CSTCE-SERIES = smd 0.6 x 1.5: 1 -1.2,0; 2 0,0; 3 1.2,0

### Placement (x,y rotation side)
C1  22.75,13.02 0 top
C2  11.1,13.86 180 top
C3  23.01,2.68 270 top
C4  8.17,4.81 0 top
C5  40.61,9.26 180 bottom
C6  30.43,1.99 180 top
C7  30.43,3.09 0 top
C8  9.07,11.13 90 top
C9  7.67,11.13 90 top
C10  5.88,15.84 0 top
C11  6.71,20.86 90 top
C12  13.02,15.56 180 top
C13  23.19,15.4 0 bottom
C14  31.76,5.4 90 bottom
C15  32.88,12.76 90 bottom
C16  20.16,5.3 270 bottom
C17  48.8,5.59 0 bottom
C18  19.01,6.38 90 bottom
C19  19,4.23 270 bottom
C20  28.52,5.21 270 bottom
C21  23.24,1.82 90 bottom
C22  40.84,8.18 180 top
C23  48.82,10.75 0 bottom
C24  19.22,1.26 0 bottom
C25  19.23,2.37 180 bottom
C26  7.67,2.51 180 bottom
C27  48.86,15.73 0 bottom
C28  5.78,8.42 270 top
C29  30.67,9.18 0 bottom
C30  29.05,3.56 0 bottom
C31  40.86,1.44 180 top
C32  40.86,14.83 180 top
C33  7,1.31 180 bottom
C34  30.1,9.06 90 top
C35  34.05,12.76 90 bottom
C36  32.39,5.21 90 top
C37  5.95,21.06 270 bottom
D1  37.35,11.71 180 bottom
D3  34.25,11.07 0 bottom
D4  34.82,17.85 90 bottom
J1  1.52,12.01 270 top
J2  10.62,10.31 270 bottom
J3  2.72,22.61 270 top
J4  53,5.65 90 top
J5  53,10.73 90 top
J6  1.2,1.46 90 top
J7  30.4,1.51 0 bottom
J8  53,15.81 90 top
J9  8.35,22.86 0 top
J10  40.99,14.86 0 bottom
L1  47.2,3.66 0 top
L2  47.2,10.34 0 top
L3  47.2,17.01 0 top
L4  30.43,0.87 0 top
L5  27.65,1.81 270 bottom
Q1  45.55,4.26 0 bottom
Q2  45.55,9.61 0 bottom
Q3  45.55,16.81 0 bottom
R1  9.05,13.72 90 top
R2  7.65,13.72 90 top
R3  30.43,4.21 0 top
R4  30.43,5.34 0 top
R5  23.2,14.21 0 bottom
R6  26.46,1.83 270 bottom
R7  21.48,1.37 0 bottom
R8  36.98,6.51 270 top
R9  12.07,1.61 0 bottom
R10  12.07,2.66 0 bottom
R11  36.67,12.31 90 top
R12  36.61,18.54 270 top
R13  39.25,2.06 90 bottom
R14  48.9,18.27 180 bottom
R15  48.98,13.26 180 bottom
R16  48.89,8.18 180 bottom
R17  41.32,2.72 180 bottom
R18  46.15,12.71 0 bottom
R19  32.4,2.11 270 top
R20  15.95,19.01 180 top
R21  15.95,17.66 180 top
R22  36.1,17.81 90 bottom
R23  15.7,2.61 180 bottom
R25  26.42,6.56 90 top
R26  24.98,1.82 270 bottom
R27  33.48,17.41 90 top
R28  40.59,7.89 180 bottom
R29  38.62,8.7 90 bottom
R32  8.5,8.15 90 top
U1  16.55,8.09 180 top
U2  26.4,2.54 180 top
U3  24.04,6.33 180 bottom
U4  9.53,17.92 0 top
U5  34.84,4.33 0 bottom
U6  8,2.17 90 top
U7  34.31,8.18 0 bottom
U8  37.4,14.81 90 bottom
U9  40.7,4.63 0 top
U10  40.7,11.34 0 top
U11  40.7,17.99 0 top
U12  34.05,7.81 270 top
U13  35.6,1.96 270 top
U$1  21.07,17.96 0 top
U$2  29.3,14 0 top
U$3  53.7,21.7 0 top
U$4  53.7,2.3 0 top
U$5  1.12,17.62 0 top
U$6  47.37,1.63 0 top
U$8  1.35,17.31 0 bottom
U$9  47.3,1.61 0 bottom
Y1  24.82,6.61 90 top

### Tracks (layer width: path | path; a pad name or v marks a point on that pad's centre or on a via)
#RESET  (via drill 0.2)
  Top 0.15: R20.1 R21.1 16.6,17.16 v17.4,16.36
  GND 0.15: v17.4,16.36 20,16.36 20.95,15.41 v22.05,15.41
  Bottom 0.15: v22.05,15.41 22.63,15.41 C13.2
+5V  (via drill 0.4)
  Top 0.305: v37.65,0.77 v37.65,0.76
  Top 0.406: U13.4 37.1,1.31 v37.65,0.76
  GND 0.406: v37.65,0.76 46.6,0.76 48.95,3.11 48.95,22.82 J9.17
  VCC 0.61: v29.85,7.46 31.45,7.46 v34,9.96
  Bottom 0.305: D3.A v34,9.96
  Bottom 0.406: U5.7 31.89,4.73 C14.1 | U5.6 31.78,3.93 31.77,3.91
  Bottom 0.61: v37.65,0.76 37.6,0.71 36.15,0.71 34.6,2.21 32.45,2.21 31.77,2.9 31.77,3.91 | 31.77,3.91 C14.1 | 31.77,3.91 30.9,3.91 30.15,4.66 30.15,4.71 30.05,4.81 30.05,6.91 30.35,7.21 v29.85,7.46
+5V_USB  (via drill 0.2, 0.4)
  Top 0.2: U4.12 11.49,17.41 12.4,17.41 13,18.01 13,19.16 v12.75,19.16
  Top 0.406: v6.55,16.76 6.53,16.8 C10.2 6.45,15.82 6.45,14.16 5.6,13.31 J1.1
  VCC 0.406: v12.75,19.16 12.7,19.21 | 12.7,19.21 9,19.21 v6.55,16.76 | 12.7,19.21 16.2,19.21 17.15,18.26 18.95,18.26 19.75,17.46 19.75,16.11 19.9,15.96 20.35,15.96 20.95,15.36 20.95,13.56 22.8,11.76 32.4,11.76 33,12.36 33,14.26 32.89,14.37 | 32.89,14.37 31.96,14.37 v32.05,14.36 | 32.89,14.37 33.51,14.37 34.8,15.66 v34.8,18.26
  Bottom 0.406: v32.05,14.36 32.88,14.36 | D4.A 34.8,19.08 v34.8,18.26 34.9,18.36 R22.2 36.95,18.36 37.2,18.11 37.2,16.31 37.75,15.76 U8.4
ACC_IRQ1  (via drill 0.2)
  Top 0.15: U1.59 17.8,2.27 17.8,2.26 v17.8,3.56 | v24.05,3.21 24.05,3.11 24.6,2.56 25.11,2.56 U2.11
  VCC 0.15: v17.8,3.56 22.65,3.56 23,3.21 v24.05,3.21
ACC_IRQ2  (via drill 0.2)
  Top 0.15: U1.58 17.3,3.21 17.2,3.31 17.2,4.01 v17.45,4.26 | v24.25,4.11 24.25,3.76 24.5,3.51 25.1,3.51 U2.9
  VCC 0.15: v17.45,4.26 18,4.26 18.4,3.86 24,3.86 v24.25,4.11
AGND  (via drill 0.2)
  Top 0.406: U6.7 7.68,1.85 U6.EP1 8,1.81 v8.35,1.46
  GND 0.3: v20.95,2.46 v22.1,2.46
  Bottom 0.2: C25.2 19.78,2.46 v20.95,2.46
  Bottom 0.3: U3.17 28.05,5.31 28.5,5.76 C20.1 29.15,5.76 29.4,5.51 29.4,3.76 C30.1
  pour Bottom: 17.2,5.26 20.8,5.21 20.8,5.86 27.7,5.86 27.7,1.81 26.4,0.51 4.5,0.51 4.2,0.81 4.2,3.11 4.9,3.91 17.2,3.96
AMP_MUTE
  Top 0.15: U6.1 13.08,1.2 13.3,1.41 U1.50
AVDD
  Bottom 0.3: J7.2 29.35,1.51 28.85,2.01 28,2.01 L5.1
  Bottom 0.305: U3.19 27.51,4 27.95,3.56 C30.2 27.65,2.71 L5.1
BOOT  (via drill 0.2)
  Top 0.15: v31.85,16.21 31.85,17.34 U$1.5 R27.2 | U1.60 18.35,2.34 18.35,10.56 19.9,12.11 v20.05,12.11
  Bottom 0.15: v20.05,12.11 20.5,12.11 20.95,11.66 21.4,11.66 22.65,12.91 23.3,12.91 23.5,13.11 25.15,13.11 28.45,16.41 31.65,16.41 v31.85,16.21
EXT_POWER  (via drill 0.2, 0.3)
  Top 0.406: U11.6 42.61,17.61 v43.37,17.61 43.53,17.6 v43.53,16.85 43.54,16.83 v43.54,16.08 v43.54,15.08 v43.54,14.28 | U11.1 v37.95,19.19 | U10.6 v43.39,10.94 43.55,10.93 v43.55,9.26 | v43.55,9.26 v43.55,9.98 | U10.1 v37.95,12.54 | U9.6 v43.37,4.22 43.53,4.2 v43.53,3.44 v43.53,2.63 v43.53,1.89 43.53,1.84 | U9.1 38.79,5.84 v38.81,6.79 | v43.54,7.78 v43.54,8.53 43.49,9.26 v43.55,9.26
  Top 0.61: v43.54,8.53 42.19,8.53 C22.1 | C32.1 43.28,14.83 v43.54,15.08 | C31.1 43.09,1.44 v43.53,1.89
  VCC 0.2: v43.53,3.44 43.57,3.44 43.64,3.51
  VCC 0.406: v37.95,19.19 37.97,19.21 | 43.64,4.34 43.64,1.95 43.55,1.86 | 43.36,10.96 v43.39,10.94 | 43.61,6.79 43.64,6.76 | v43.54,7.78 43.54,6.76 43.64,6.66
  VCC 0.61: 37.97,20.56 38,20.59 | 43.64,19.71 43.37,19.45 v43.37,17.61 43.35,17.59 U11.6 40.99,19.21 37.97,19.21 | 43.56,12.54 43.64,12.46 | 43.51,6.79 43.54,6.76 | v37.95,12.54 41,12.54 U10.6 v43.39,10.94 | v38.81,6.79 39.42,6.79 42,4.21 v43.37,4.21 v43.37,4.22
  VCC 1.016: v43.53,3.44 43.53,2.8
  VCC 1.676: J3.1 2.76,22.64 4.62,22.64 6.67,20.59 38,20.59 43.44,20.59 43.64,20.4 43.64,19.71 43.64,12.46 43.64,6.76 43.64,6.66 43.64,4.34 43.64,3.51
  Bottom 0.15: R28.2 42.86,7.89 42.86,7.9 v43.54,8.53
  Bottom 0.305: U5.3 36.75,3.91 37.3,3.91 37.7,3.51 37.7,1.61 38.85,1.61 39.25,1.36
  Bottom 0.406: 43.52,16.06 v43.54,16.08 | J10.1 43.32,14.86 v43.54,15.08
  Bottom 0.61: v43.53,2.63 43.55,2.61 43.55,1.36 41.15,1.36 40.35,1.36 39.25,1.36 R13.1
  Bottom 0.813: C37.1 3.28,22.05 J3.1
GND  (via drill 0.2, 0.4)
  Top 0.15: C9.1 v8.37,10.48 C8.1 | C2.2 10.55,14.76 v10.47,14.78 | C12.2 12.37,16.48 v12.47,16.38 | R27.1 33.63,16.75 v33.99,16.39 | Y1.2 23.73,6.61 v23.72,6.63 | U2.7 26.4,3.02 26.35,3.01 | 26.35,3.01 25.7,3.01 U2.10 | 26.35,3.01 26.35,2.76 25.63,2.04 U2.12 24.65,2.04 24.33,2.37 24.08,2.37 v24.07,2.38 | U2.5 27.43,3.54 26.9,3.01 26.35,3.01 | C1.2 23.3,12.76 v23.6,12.46 | U1.28 14.8,13.21 14.55,12.96 13.4,12.96 13.3,13.06 U1.31 | C36.2 32.35,5.91 32.7,6.26 v33,6.26 | 39.94,14.81 C32.2 | U11.4 37.07,16.79 36.6,17.26 R12.2 | R8.2 36.2,5.96 v35.95,6.21 | R11.2 36.69,12.86 37.4,13.56 37.4,14.77 v37.42,14.79 | v40.69,17.03 40.69,17.3 40.7,17.31
  Top 0.2: 40.02,18.51 v40.02,17.02 v40.02,17.03 v40.69,17.03 v41.38,17.03 | 40,11.78 40.02,11.77 v40.02,10.39 | v40.02,10.39 v40.69,10.39 v41.36,10.39 | v40.02,10.39 40.16,10.25 40.16,10.21 | R12.2 36.65,17.93 | v12.4,18.36 12.05,17.91 U4.13 U4.21 U4.3 6.24,17.92 6,18.16 v6,19.01 6,19.56 6.64,20.21 C11.1 | U1.31 13.3,14.63 C12.2 11.26,15.56 v10.47,14.78 | v24.07,2.38 23.25,2.38 C3.2 | U1.63 19.78,2.32 19.78,1.32 19.87,1.23 20.47,1.23 | U1.47 8.76,4.84 C4.2 8.72,5.63 v8.77,5.68 | C7.2 31.04,3.31 31.3,3.31 31.67,3.69 31.67,5.39 32.05,5.76 C36.2
  Top 0.3: C6.1 30.83,2.53 C7.2
  Top 0.305: J1.5 J1.6 4.07,8.63 v3.57,8.13 | v4.45,4.26 4.2,4.26 4.2,4.81 | 38.82,3.41 U9.4 | U1.12 23.04,9.84 v23.4,9.46 | U1.18 19.8,15.06 v19.85,15.11
  Top 0.406: U11.4 40.19,16.8 40.7,17.31 U11.EP 40.7,18.67 40.71,18.67 41.23,19.19 U11.8 | U10.8 41.18,12.55 40.7,12.06 U10.EP 40.7,10.75 40.16,10.21 40.07,10.12 38.82,10.12 U10.4 | U9.8 42.58,5.8 41.29,5.8 40.7,5.22 U9.EP 40.7,3.96 40.15,3.41 40.03,3.41 38.82,3.41 | C34.2 v29.35,9.61 | U13.2 U13.5 37.45,1.96 37.65,2.16 37.65,2.96 | 37.65,2.96 37.1,3.51 v35.75,3.51 | U9.4 38.11,3.43 37.65,2.96 | U12.5 v33.9,7.81 U12.2 | J1.5 1.62,10.71 J1.8
  Top 0.61: C32.2 40.19,15.07 40.19,16.8 | C22.2 40.07,8.32 40.07,10.12 | C31.2 40.03,1.52 40.03,3.41 | J1.10 J1.9 J1.8 | 4.2,4.81 4.2,8.79 J1.6 4.47,8.51 J2.6 4.73,7.87 C28.2 | J1.7 3.48,8.21 v3.57,8.13
  GND 0.15: v27.57,8.53 27.55,8.55 27.55,9.46 27.7,9.61 27.8,9.61 27.81,9.61 v29.35,9.61
  GND 0.305: 21.02,18.01 U$1.1
  VCC 0.15: v12.47,16.38 12.47,18.29 v12.4,18.36
  Bottom 0.15: 4.77,3.09 J2.E | R29.1 38.62,7.67 v37.94,6.99 | v35.7,4.31 v35.7,5.11 v33.95,5.11 33.95,6.26 33.9,6.31 | v35.7,4.31 35.7,3.56 v35.75,3.51 | v35.7,4.31 35.7,3.61 35.9,3.41 34.05,3.41 v33.95,3.51 34.03,3.51 U5.P$1 | C29.2 29.69,9.61 v29.35,9.61 | R18.2 45.7,12.61 45.7,12.01 46,11.71 47.97,11.71
  Bottom 0.2: v6,19.01 6,17.91 5.9,18.01 J2.A | U5.P$1 | C18.1 17.79,5.83 J2.D | v27.57,8.53 26.68,8.53 U3.12 | C5.2 41.16,9.52 41.35,9.71 41.35,10.38 v41.36,10.39
  Bottom 0.3: U3.4 22.7,5.31 22.95,5.56 22.95,6.41 23.16,6.63 v23.72,6.63 25.4,6.63 | U3.15 26.65,6.63 25.4,6.63 | 26.68,8.53 26.64,8.56 25.65,8.56 25.4,8.31 25.4,6.63 | R23.2 16.26,2.62 J2.G 16.26,5.33 | 4.45,3.71 v4.45,4.26 | 16.26,5.33 16.7,5.76 J2.D | v14.52,5.63 14.61,5.63 15.1,6.11 15.47,6.11 16.26,5.33
  Bottom 0.305: 4.45,3.71 4.45,3.41 J2.E 4.75,3.07 | 31.97,6.26 v33,6.26 33.2,6.31 33.9,6.31 34.31,6.72 34.31,7.21 34.31,7.66 U7.EP | v35.7,5.11 35.75,5.11 36.15,5.51 36.73,5.51 U5.1 | R17.2 41.87,3.65 v40.7,3.67 | U3.15 27.61,6.6 27.65,6.56 | 27.65,6.56 27.65,6.06 27.55,5.96 U3.16 | 27.65,6.56 27.96,6.56 v28.17,6.63
  Bottom 0.406: 21.02,18.01 U$1.1 | v32.04,13.34 31.97,13.31 C15.2 C35.2 | U7.4 34.32,7.21 34.31,7.21 | v33.9,7.81 34.16,7.81 34.31,7.66 | U8.2 37.4,14.81 v37.42,14.79 | R22.1 v36.1,16.59 v36.09,16.58
  Bottom 0.61: J2.6 v3.58,8.12 v3.57,8.13 | J2.B 17,18.01 17.4,18.41 20.62,18.41 U$1.1
  Bottom 0.813: C37.2 5.95,19.61 | 5.95,19.61 5.95,18.06 5.9,18.01 | J3.2 5.95,19.61
  Bottom 1.016: 48.03,15.71 R15.1 47.97,13.2 47.97,11.71 C23.2 | 47.94,10.72 R16.1 47.95,8.17 C17.2 | C27.2 48.01,18.21 R14.1 47.95,19.77 46.45,21.26 J9.16 J9.15
  other vias: 40,5 40,4.07 34.85,5.11 15.47,9.28
  pour Top: -1,25 -1,-1 57,-1 57,25
  pour GND: -1.5,25.5 -1.5,-1.5 57.5,-1.5 57.5,25.5
  pour Bottom (rank 2): -2.5,26.5 -2.5,-2.5 58.5,-2.5 58.5,26.5
  pour VCC: 36.8,21.51 36.8,0.41 55.75,0.36 55.75,21.56 37.65,21.56 37.65,21.46
  pour VCC: 4.1,4.71 4.1,0.91 22.45,1.01 22.45,3.46 22.5,3.51 4.95,3.56 4.95,4.71
I2C1_SCL  (via drill 0.2)
  Top 0.15: U2.4 28.28,3.04 | 28.28,3.04 28.6,3.36 28.6,3.71 28.9,4.01 29.61,4.01 R3.1 | 28.28,3.04 28.37,3.04 28.6,2.81 v28.6,2.66 | U1.61 18.8,3.46 18.65,3.61 18.65,10.36 19.65,11.36 v20.35,11.36
  GND 0.15: v28.6,2.66 28.6,4.96 28.85,5.21 v28.85,8.31
  Bottom 0.15: U3.14 28.2,7.26 28.85,7.91 v28.85,8.31 28.85,9.31 26.25,11.91 22.1,11.91 21.55,11.36 v20.35,11.36
I2C1_SDA  (via drill 0.2)
  Top 0.15: U2.6 26.9,4.47 27.8,5.36 29.6,5.36 R4.1 29.7,5.36 29.7,6.06 28.3,7.46 v28.3,8.91 | U1.62 19.3,3.46 18.95,3.81 18.95,10.16 19.25,10.46 v20.95,10.46
  Bottom 0.15: U3.13 27.8,7.91 28.25,8.36 28.3,8.36 v28.3,8.91 26.65,10.56 25.05,10.56 24.35,11.26 22.35,11.26 21.55,10.46 v20.95,10.46
I2C2_SCL  (via drill 0.2)
  Top 0.15: U1.29 14.3,14.67 15.05,15.41 v15.2,15.41
  GND 0.15: v14.3,18.51 14.3,20.26 13.45,21.11 13.45,22.71 | 13.45,22.71 13.45,22.81 | J9.3 13.43,22.73 13.45,22.71
  Bottom 0.15: v15.2,15.41 15.2,16.11 14.8,16.51 14.8,18.01 v14.3,18.51
I2C2_SDA  (via drill 0.2)
  Top 0.15: v16.75,10.71 16.75,9.41 16,8.66 16,3.36 15.8,3.16 U1.55
  Bottom 0.15: J9.4 15.97,21.64 16.65,20.96 18.3,20.96 19.05,20.21 21.25,20.21 22.35,19.06 22.35,17.16 22.15,16.96 21.85,16.96 20.8,15.91 18.35,15.91 16.75,14.31 16.75,12.76 16.95,12.56 16.95,11.61 16.75,11.41 v16.75,10.71
I2S2_CK  (via drill 0.2)
  Top 0.15: v11.95,11.36 10.83,11.31 U1.34
  Bottom 0.15: v11.95,11.36 13.25,11.36 13.45,11.16 14.25,11.16 15.1,10.31 15.1,10.06 15.3,9.86 16.5,9.86 17.65,8.71 20.3,8.71 20.8,9.21 21.58,9.21 U3.10
I2S2_MCK  (via drill 0.2)
  Top 0.15: U1.37 11.47,9.84 11.65,9.66 12.7,9.66 12.9,9.46 13.45,9.46 13.75,9.76 v13.75,11.71
  Bottom 0.15: v13.75,11.71 13.8,11.66 14.25,11.66 15.4,10.51 15.4,10.21 15.45,10.16 16.65,10.16 17.8,9.01 20.15,9.01 20.75,9.61 22.55,9.61 23.3,8.86 23.8,8.86 24.15,9.21 26.66,9.21 U3.11
I2S2_SD  (via drill 0.2)
  Top 0.15: U1.36 11.47,10.34 11.8,10.01 v13.2,10.01
  Bottom 0.15: U3.8 21.58,7.91 20.6,7.91 20.45,8.06 18.4,8.06 17.75,7.41 14.85,7.41 14.35,7.91 14.35,9.76 14.1,10.01 v13.2,10.01
I2S2_WS  (via drill 0.2)
  Top 0.15: v12.85,10.76 12.85,11.31 12.25,11.91 10.82,11.91 U1.33
  Bottom 0.15: U3.9 21.58,8.56 20.65,8.56 20.45,8.36 17.55,8.36 17.2,8.71 15,8.71 14.75,8.96 14.75,10.21 14.2,10.76 v12.85,10.76
IO-1  (via drill 0.2)
  Top 0.15: J9.5 18.51,17.43 v18.52,17.52 | v15.4,12.46 15.8,12.91 U1.26
  VCC 0.15: v18.52,17.52 18.52,16.56 U1.26 15.8,12.92 v15.4,12.46
IO-2
  Top 0.15: U1.27 15.3,14.57 15.5,14.76 16.55,14.76 19.1,17.31 19.1,20.91 J9.6
LED_SWITCH  (via drill 0.2)
  Top 0.15: U1.20 18.8,15.21 19.35,15.76 21.05,15.76 21.25,15.96 24.55,15.96 25.05,16.46 30.4,16.46 31.85,15.01 33.15,15.01 v33.45,15.31
  GND 0.15: v33.45,15.31 34.35,15.31 35.75,13.91 40.3,13.91 v40.65,13.56
  GND 0.2: v46.95,2.81 47.8,3.66 47.8,7.71 v46.85,8.51 47.8,9.31 47.8,13.86 v47,14.66
  Bottom 0.15: R18.1 46.7,13.11 47,13.41 v47,14.66 | v40.65,13.56 43.85,13.56 45.15,14.86
  Bottom 0.2: Q1.3 44.9,2.51 45.15,2.26 46.4,2.26 v46.95,2.81 | v46.85,8.51 46.85,7.91 46.6,7.66 45.1,7.66 44.9,7.86 Q2.3 | v47,14.66 45.35,14.66 45.15,14.86 44.9,15.11 Q3.3
N$1
  Top 0.15: R1.2 9.15,14.37 10.05,15.26 10.05,16 U4.9
N$2
  Top 0.15: R2.2 7.7,14.37 8.55,15.21 9.35,15.21 9.55,15.41 9.55,16 U4.8
N$3  (via drill 0.2)
  Top 0.15: C8.2 9.07,12.4 v8.6,12.41 9.05,12.42 R1.1 | v6.65,12.66 J1.2
  Bottom 0.15: v6.65,12.66 6.9,12.41 v8.6,12.41
N$4
  Top 0.15: R2.1 7.67,13.05 C9.2 6.08,11.68 5.75,12.01 J1.3
N$5  (via drill 0.2)
  Top 0.2: v10.7,2.86 10.65,2.86 10.35,3.16 9.67,3.16 U6.4
  Bottom 0.2: R10.2 10.9,2.66 v10.7,2.86
N$6  (via drill 0.2)
  Top 0.15: U4.10 11.21,15.92 11.5,16.21 11.5,16.89 | 11.5,16.89 U4.11 | 11.5,16.89 11.5,16.91 11.55,16.96
  Top 0.2: U4.20 8.53,20.88 7.9,21.51 6.75,21.51 C11.2 6.6,21.41 v6.6,23.31 | 11.55,16.96 12.95,16.96 v13.35,16.56
  Bottom 0.2: v13.35,16.56 13.3,16.56 12.7,17.16 10.65,17.16 7.65,20.16 7.65,21.41 7.05,22.01 7.05,22.86 v6.6,23.31
N$7
  Top 0.15: 29.75,3.04 C7.1 29.86,3.11 29.3,3.11 29.2,3.01 29.2,2.48 28.73,2.01 27.78,2.01 U2.2
N$8
  Top 0.406: U9.7 44.84,5.03 44.85,5.02 L1.1
N$9  (via drill 0.2)
  Top 0.15: v19.95,9.56 19.95,8.76 21.3,7.36 22.28,7.36 U1.7
  GND 0.15: v19.95,9.56 19.95,10.21 21.15,11.41 v21.15,12.36
  Bottom 0.15: v21.15,12.36 22.05,13.26 23.2,13.26 23.64,13.7 23.64,14.21 R5.1 23.75,15.39 C13.1
N$10
  Top 0.15: U1.5 22.33,6.31 23.2,6.31 24.1,5.41 Y1.1 25.75,5.41 26.25,5.91 R25.1
N$11
  Top 0.15: U1.6 22.32,6.86 23.15,6.86 24.1,7.81 Y1.3 25.7,7.81 26.3,7.21 R25.2
N$12
  Bottom 0.305: U3.3 20.26,4.65 C16.2
N$13  (via drill 0.2)
  Top 1.016: 49.71,5.65 J4.1 49.59,5.65 49.55,5.61 L1.2
  VCC 0.406: v46.95,4.16 49.26,4.16 50.75,5.65 J4.1
  Bottom 0.406: Q1.2 Q1.1 46.2,4.16 | 46.2,4.16 Q1.6 Q1.5 | 46.2,4.16 v46.95,4.16
  Bottom 1.016: J4.1 49.71,5.65 C17.1
N$14
  Bottom 0.305: U3.5 20.26,5.95 C16.1
N$15
  Bottom 0.305: U3.2 20.49,4 20.15,3.66 19.02,3.66 C19.2
N$16  (via drill 0.2)  (1 unrouted)
  Top 0.2: U9.3 38.03,4.23 37.9,4.36 37.9,4.95 v37.87,4.98
  VCC 0.2: v46.4,6.96 49.48,6.96 50.7,8.18 J4.2
  Bottom 0.2: v37.87,4.98 38.92,4.98 40.9,6.96 43.1,6.96 43.11,6.96 44.9,6.96 | R16.2 | 44.9,6.96 v46.4,6.96 | Q1.4 44.9,6.96
  Bottom 1.016: 52.8,8.18 R16.2
N$17
  Bottom 0.305: U3.18 C20.2
N$18
  Bottom 0.305: U3.20 26.68,2.45 R6.1
N$19
  Bottom 0.15: R7.1 21.5,1.9 21.5,2.81 21.6,2.91 U3.1
N$20
  Top 0.15: U4.19 9.03,20.59 9.65,21.26 12.4,21.26 14.7,19.01 R20.2
N$21
  Bottom 0.2: 23.21,1.29 23.18,1.26 | C21.1 23.24,0.85 23,0.61 21.1,0.61 20.9,0.81 20.9,1.34 R7.2 19.78,1.37 C24.1
  Bottom 0.305: 23.21,1.29 C21.1 R26.2 26.59,1.27 R6.2
N$22
  Top 0.15: U4.18 9.53,20.59 9.85,20.91 12.25,20.91 13.75,19.41 13.75,18.11 14.2,17.66 R21.2
N$23
  Bottom 0.15: R9.1 12.62,1.59 13.35,0.86 18.27,0.86 C24.2
N$24  (via drill 0.2)
  Top 0.2: U6.3 10.22,2.5 10.55,2.16 v10.55,1.86
  Bottom 0.2: v10.55,1.86 10.85,1.56 11.47,1.56 R9.2
N$25
  Top 0.406: L4.2 31.91,0.87 R19.2
N$26
  Bottom 0.15: R10.1 13.05,2.66 13.35,2.36 13.35,1.36 13.55,1.16 17.5,1.16 17.8,1.46 17.8,2.11 18.05,2.36 C25.1
N$27
  Top 0.3: U6.8 4.32,1.2 4.05,1.46
  Top 0.305: 4.05,1.46 J6.1
N$28  (via drill 0.2)
  Top 0.2: U11.3 38.02,17.59 v38,17.61
  VCC 0.2: v44.95,20.35 v49.85,20.35
  Bottom 0.2: 49.85,18.33 R14.2 v49.85,20.35 | v38,17.61 39.65,17.61 40.9,18.86 44.95,18.86 | 44.95,18.86 v44.95,20.35 | 44.95,18.86 44.95,17.96 Q3.4
  Bottom 1.27: J8.2 49.92,18.35 R14.2
N$29  (via drill 0.2, 0.4)
  Top 0.406: U6.6 5.33,2.5 v5.35,1.91 | v28.74,0.66 29.42,0.66 L4.1
  VCC 0.406: v5.35,1.91 5.35,1.21 5.55,1.01 7,1.01 7.35,0.66 v28.74,0.66
  Bottom 0.406: C26.1 6.45,2.25 C33.1 5.95,1.31 v5.35,1.91 | J7.1 31.1,0.61 30.9,0.53 28.97,0.52 28.87,0.6 v28.74,0.66
N$30  (via drill 0.2)
  Top 0.2: U10.3 38.77,10.97 v38.05,10.87
  VCC 0.2: J5.2 52.99,13.26 R15.2 49.47,13.71 v46.4,13.71
  Bottom 0.2: 49.93,13.35 R15.2 | v38.05,10.87 39.55,10.87 41.4,12.71 44.2,12.71 | 44.2,12.71 44.9,12.01 Q2.4 | 44.2,12.71 44.2,13.36 44.55,13.71 v46.4,13.71
  Bottom 1.016: J5.2 49.94,13.27 R15.2
N$31
  Bottom 0.305: U7.3 U7.2 U7.1 35.81,10.66 D3.C
  Bottom 0.406: 35.82,10.6 D3.C 35.5,11.56 | C35.1 35,12.21 | 35.5,11.56 35.5,11.71 35,12.21 | D4.C 34.82,14.15 35.1,13.86 | 35.1,13.86 35.1,12.31 35,12.21 | U8.1 35.1,13.86 | D1.C 35.65,11.71 35.5,11.56
N$32
  Bottom 0.305: U5.2 37.19,4.73 38.7,3.21 38.95,3.21
  Bottom 0.406: R17.1 40.58,2.91 R13.2 38.95,3.21
N$33  (via drill 0.3)
  Top 1.016: L2.2 49.55,10.63 C23.1 52.98,10.75 J5.1
  VCC 0.406: v46.85,9.61 49.58,9.61 50.7,10.73 J5.1
  Bottom 0.406: Q2.5 Q2.6 46.2,9.61 | 46.2,9.61 Q2.1 Q2.2 | 46.2,9.61 v46.85,9.61
  Bottom 1.016: J5.1 49.69,10.73 C23.1
N$34  (via drill 0.3)  (1 unrouted)
  Top 1.016: 52.72,15.73 J8.1 49.79,15.81 C27.1 49.55,15.88
  VCC 0.406: v46.75,16.86 49.35,16.86 50.4,15.81 J8.1
  Bottom 0.406: Q3.5 Q3.6 46.2,16.86 | Q3.2 Q3.1 46.2,16.86 | 46.2,16.86 v46.75,16.86
  Bottom 1.016: 49.79,15.81 C27.1 52.92,15.73 J8.1
N$35
  Top 0.406: U10.7 42.61,11.73 44.85,11.73 L2.1
N$36
  Top 0.406: U11.7 42.61,18.41 43.16,18.41 43.17,18.4 44.85,18.4
  Top 0.61: 44.85,18.41 44.85,18.4 L3.1
N$37
  Top 0.3: U6.5 5.42,3.15 5.1,3.46 J6.2
N$38
  Bottom 0.406: J10.2 40.15,14.86 40.15,14.11 39.9,13.86 U8.5 38.8,11.91 D1.A
N$41
  Bottom 0.15: U7.6 32.51,7.81 32.25,8.06 32.25,8.86 31.9,9.21 31.25,9.21 C29.1
N$42
  Top 0.15: C12.1 13.57,14.99 13.85,14.71 13.85,13.89 U1.30
ON_3.3V
  Top 0.15: U1.10 23.58,8.84 24.3,9.56 25.55,9.56 26.85,10.81 31.9,10.81 32.25,11.16 35,11.16 35.15,11.01 U12.6
ON_5V  (via drill 0.2)
  Top 0.15: U1.9 23.53,8.34 24.4,9.21 25.65,9.21 26.95,10.46 31,10.46 v31.25,10.21 | U13.6 35.8,2.61 34.1,4.31 33.6,4.31 33.2,4.71 33.2,5.61 33.6,6.01 v34.5,6.01
  GND 0.15: v31.25,10.21 31.25,9.26 v34.5,6.01
PA3  (via drill 0.2)
  Top 0.15: U1.17 20.3,14.62 20.5,14.81 23.9,14.81 24.1,14.61 25.45,14.61 v26.75,15.86
  GND 0.15: J9.7 27.45,19 27.45,16.56 v26.75,15.86
PC4  (via drill 0.2)
  Top 0.15: U1.24 16.8,12.56 17.45,11.91 v17.45,11.11
  GND 0.15: v18.8,11.76 18.1,11.76 v17.45,11.11
  Bottom 0.15: J9.8 24.9,21.63 24.9,17.51 23.7,16.31 22.15,16.31 20.9,15.06 20.9,13.91 19.4,12.31 18.85,11.76 v18.8,11.76
PC5  (via drill 0.2)
  Top 0.15: v33.1,19.16 30.3,19.16 29.95,18.81 29.95,17.36 31.75,15.56 v32.65,15.56 | U1.25 16.3,12.27 v16.05,12.01
  GND 0.15: v16.05,12.01 16.3,12.32 U1.25 16.87,14.41 20.8,14.41 21.2,14.81 22.2,14.81 23.3,15.91 25,15.91 25.7,15.21 27.3,15.21 28.3,16.21 31.1,16.21 31.75,15.56 v32.65,15.56
  Bottom 0.15: v33.1,19.16 31.21,21.05 30.48,21.05 J9.9
POW_3.3V  (via drill 0.2, 0.4)
  Top 0.15: v8.85,9.46 R32.8 R32.6 R32.4 R32.2 | 27.7,1.52 U2.1 | U2.14 25.9,1.76 26.05,1.91 27.05,1.91 27.42,1.54 U2.1 | U2.1 27.7,1.51 28.2,1.51 v28.5,1.41
  Top 0.305: R3.2 30.91,4.03 R4.2 30.9,5.36 v30.9,6.31
  Top 0.406: C28.1 5.78,9.84 v5.75,10.31 | v30.9,6.31 30.9,7.06 | 30.9,7.06 30.9,7.46 31.1,7.66 | 31.1,7.66 31.6,7.66 | 31.6,7.66 31.65,7.66 | 30.92,7.05 30.9,7.06 | C34.1 30.95,7.66 31.1,7.66 | 31.6,7.66 32.4,8.46 U12.1 | C6.2 29.42,1.99 28.87,1.41 v28.5,1.41
  GND 0.406: v30.9,6.31 30.89,3.71 v28.5,1.41
  VCC 0.2: v8.85,9.46 9.65,10.26 9.65,10.31
  VCC 0.406: 6.8,10.31 v5.75,10.31
  VCC 0.61: 6.8,10.31 7.75,11.26 8.7,11.26 9.65,10.31 11.25,8.71 11.25,7.01 11.75,6.51 13.05,6.51 13.8,7.26 17.3,7.26 17.45,7.41 v20,7.41 28.6,7.41 29.7,6.31 v30.9,6.31
  Bottom 0.3: 20.41,6.6 U3.6 | v20,7.41 20,6.91
  Bottom 0.305: 20.41,6.6 20.1,6.91 20,6.91 C18.2
  Bottom 0.406: v28.5,1.41 27.8,1.41 L5.2
  Bottom 0.61: J2.4 5.79,10.32 v5.75,10.31
POW_5V
  Top 0.406: C36.1 R19.1 32.45,2.91 33.5,2.91 33.8,2.61 U13.1
PWM1
  Top 0.15: U1.14 23.53,10.84 23.85,11.16 31.8,11.16 32.1,11.46 35.6,11.46 36.1,10.96 37,10.96 38.5,9.46 38.5,8.16 37.9,7.56 37.48,7.56 R8.1 | R8.1 37.1,7.06 38.1,6.06 38.1,5.56 38.3,5.36 38.56,5.11 U9.2 | 36.9,7.14 R8.1 | 36.95,7.09 R8.1
  Top 0.2: U9.2 38.79,5.01
PWM2
  Top 0.15: U1.15 23.53,11.34 23.7,11.51 31.65,11.51 31.9,11.76 R11.1 38.78,11.76 U10.2
PWM3  (via drill 0.2)
  Top 0.15: U11.2 37.87,18.39 37.2,19.06 36.63,19.06 R12.1 36.58,19.06 35.8,19.06 35.5,18.76 35.5,14.06 33.9,12.46 v31.6,12.46 | U1.16 24.28,11.84 v24.9,12.46
  Bottom 0.15: v24.9,12.46 26.2,12.46 27.15,11.51 30.65,11.51 v31.6,12.46
SD_CD  (via drill 0.2)
  Top 0.15: v9.7,5.61 9.7,6.06 9.9,6.26 9.9,7.71 10.05,7.86 10.78,7.86 U1.41
  Bottom 0.15: J2.CD 7.3,3.97 7.3,4.71 7.6,5.01 9.35,5.01 9.7,5.36 v9.7,5.61
SDIO_CK  (via drill 0.2)
  Top 0.15: U1.53 14.8,4.16 v14.15,4.81
  GND 0.15: v5.95,4.66 6.2,4.86 10.65,4.86 11.15,5.36 13.6,5.36 v14.15,4.81
  Bottom 0.15: J2.5 3.16,9.22 2.75,8.81 2.75,5.61 3.3,5.06 5.55,5.06 v5.95,4.66
SDIO_CMD  (via drill 0.2)
  Top 0.15: v15.3,5.11 15.3,4.51 15.45,4.36 15.45,3.31 15.3,3.16 U1.54
  GND 0.15: v6.25,11.06 6.2,11.06 6.55,10.71 6.55,9.11 6.4,8.96 6.4,6.71 6.75,6.36 14.95,6.36 15.3,6.01 v15.3,5.11
  Bottom 0.15: J2.3 5.89,11.42 v6.25,11.06
SDIO_D0  (via drill 0.2)
  Top 0.15: v7.05,7.71 7.57,7.71 R32.3 | 10.82,8.86 U1.39 11.97,8.84 v12.3,8.51
  GND 0.15: v7.05,7.71 7.09,7.75 R32.3 7.82,7.96 7.82,7.98 8.35,8.51 v12.3,8.51
  Bottom 0.15: J2.7 5.41,7.02 6.1,7.71 v7.05,7.71
SDIO_D1  (via drill 0.2)
  Top 0.15: v7.05,6.91 7.54,6.91 R32.1 | v12.8,7.91 12.1,7.91 11.65,8.36 10.82,8.36 U1.40
  GND 0.15: v7.05,6.91 7.11,6.85 R32.1 7.97,7.21 8.7,7.94 12.23,7.94 v12.8,7.91
  Bottom 0.15: J2.8 5.56,5.92 5.75,6.11 5.75,6.81 5.95,7.01 6.95,7.01 v7.05,6.91
SDIO_D2  (via drill 0.2)
  Top 0.15: v7.1,9.46 R32.7 | U1.51 13.8,3.11 13.35,3.56 v13.35,4.81
  Bottom 0.15: J2.1 5.94,13.62 6.1,13.46 6.1,12.41 7.2,11.31 7.2,9.56 v7.1,9.46 8.1,9.46 11.2,6.36 11.2,4.56 11.5,4.26 12.8,4.26 v13.35,4.81
SDIO_D3  (via drill 0.2)
  Top 0.15: v7.05,8.56 R32.5 | v14.15,4.01 14.3,3.81 U1.52
  Bottom 0.15: v14.15,4.01 14.05,3.96 11.35,3.96 10.8,4.51 10.8,6.26 8.5,8.56 v7.05,8.56 6.55,9.06 6.55,9.71 6.9,10.06 6.9,11.16 5.54,12.52 J2.2
SPI1_CS
  Top 0.15: U1.23 17.3,15.07 19.45,17.21 19.45,19.46 21.65,21.61 30.16,21.61 J9.10
SPI1_MISO
  Top 0.15: J9.12 34.69,21.26 21.75,21.26 19.75,19.26 19.75,17.06 17.8,15.11 U1.22
SPI1_MOSI  (via drill 0.2)
  Top 0.15: 24.34,10.41 v24.4,10.21 | U1.57 16.8,6.72 17.7,7.61 v17.7,9.86
  GND 0.15: v24.65,15.36 24.2,14.91 24.2,11.26 24.4,11.06 v24.4,10.21
  Bottom 0.15: J9.11 33.75,17.56 32.95,16.76 26.05,16.76 v24.65,15.36 | v24.4,10.21 24.4,10.71 24.15,10.96 22.5,10.96 21.45,9.91 20.5,9.91 19.8,10.61 18.45,10.61 v17.7,9.86
SPI1_SCK
  Top 0.15: J9.13 36.33,20.36 27.95,20.36 27.45,19.86 27.45,17.46 26.75,16.76 24.9,16.76 24.4,16.26 21.05,16.26 20.85,16.06 19.2,16.06 18.3,15.17 U1.21
SWDCLK  (via drill 0.2)
  Top 0.15: U1.49 12.8,5.67 15.2,8.06 v15.45,8.06 | v18.8,12.56 18.25,12.01 18.25,11.16 17.05,9.96 17.05,8.51 v16.6,8.06
  Bottom 0.15: 23.65,17.92 U$1.2 23.6,17.95 23.6,16.86 23.35,16.61 22,16.61 20.6,15.21 20.6,14.06 19.15,12.56 v18.8,12.56 | v15.45,8.06 v16.6,8.06
SWDIO  (via drill 0.2)
  Top 0.15: U$1.3 25.4,17.21 24.85,17.21 24.2,16.56 21.4,16.56 21.35,16.61 v20.6,16.61 | U1.46 12.03,5.34 14.9,8.21 14.9,9.66 v15.95,10.71
  Bottom 0.15: v20.6,16.61 20.3,16.91 16.9,16.91 16.75,16.76 16.75,16.16 17.05,15.86 17.05,15.06 16.4,14.41 16.4,12.66 16.65,12.41 16.65,11.81 15.95,11.11 v15.95,10.71
USART1_RX  (via drill 0.2)
  Top 0.15: U4.17 10.03,20.5 10.15,20.61 12.1,20.61 13.4,19.31 13.4,17.81 15,16.21 15.3,16.21 v16.15,15.36 | U1.43 12.63,6.84 14.3,8.51 v14.3,12.31
  Bottom 0.15: v16.15,15.36 14.25,13.46 14.25,12.36 v14.3,12.31
USART1_TX  (via drill 0.2)
  Top 0.15: U1.42 12.17,7.34 v12.2,7.36 | v7.15,19.26 7.2,18.91 U4.1
  Bottom 0.15: v12.2,7.36 10.95,7.36 9.6,8.71 9.6,17.61 8.3,18.91 7.2,18.91 v7.15,19.26
USART6_RX  (via drill 0.2)
  Top 0.15: U1.38 10.83,9.31 12.5,9.31 v13,8.81
  Bottom 0.15: 8.4,22.66 8.4,21.26 12.1,17.56 13.4,17.56 14,16.96 14,16.16 12.35,14.51 v12.35,12.76 12.35,12.66 11.35,11.66 11.35,9.56 11.75,9.16 12.65,9.16 v13,8.81 | 8.4,22.66 8.4,22.78 | J9.1 8.35,22.71 8.4,22.66
USART6_TX  (via drill 0.2)
  Top 0.15: U1.44 12.58,6.34 14.6,8.36 14.6,10.56 v15.4,11.36
  Bottom 0.15: J9.2 10.89,22.81 10.9,22.8 10.9,21.46 11.75,20.61 14.45,20.61 15.15,19.91 15.15,17.01 16.25,15.91 16.5,15.91 16.7,15.71 16.7,15.16 14.85,13.31 14.85,11.91 v15.4,11.36
V_SENSING  (via drill 0.2)
  Top 0.15: U1.8 22.33,7.81 23.45,7.81 24.3,8.66 v24.8,8.66
  GND 0.15: v36.9,10.31 34.6,10.31 34,10.91 32.55,10.91 27.75,10.91 25.45,8.66 v24.8,8.66
  Bottom 0.15: R28.1 40.04,9.24 | 40.04,9.24 C5.1 | 40.04,9.24 38.74,9.24 R29.2 38.62,10.04 38.35,10.31 v36.9,10.31
VCC  (via drill 0.2, 0.4)
  Top 0.15: v21.8,14.21 21.8,13.42 C1.1
  Top 0.2: v23.6,10.31 23.57,10.34 U1.13 21.68,10.34 21.15,9.81 20.6,9.81 20.3,10.11 19.5,10.11 19.35,9.96 19.35,5.26 20.75,3.86 | C4.1 7.6,4.79 7.6,4.21 7.75,4.06 9.6,4.06 9.88,4.34 U1.48 10.1,4.32 v9.75,4.21 | 23.01,3.82 23.01,4.26 22.95,4.31 22.33,4.31 U1.1
  Top 0.305: v11.45,14.86 11.65,14.66 C2.1 12.78,13.86 U1.32 | U1.64 20.3,3.41 20.75,3.86 21.25,4.36 22.28,4.36 U1.1 | C3.1 23.01,3.82 | C1.1 20.91,13.02 20.7,12.81 19.45,12.81 19.3,12.96 U1.19
  Top 0.406: U12.4 35.95,7.16 36.1,7.31 36.1,7.96 36.4,8.26 v37.6,8.26
  Top 0.61: v36.75,9.41 37.55,8.66 v37.6,8.26
  GND 0.61: J9.14 41.37,21.58 40.6,20.81 31.54,20.81 U$1.4
  VCC 0.15: v21.8,14.21 24.4,14.21 25.5,15.31 25.5,16.46 25.8,16.76 27.49,16.76 U$1.4
  VCC 0.406: v32.45,9.91 32.45,10.26 33,10.81 35.45,10.81 v36.75,9.41
  Bottom 0.15: R5.2 v21.81,14.21 v21.8,14.21
  Bottom 0.305: U7.7 32.66,8.5 32.65,8.51 32.65,8.95 U7.8
  Bottom 0.406: U7.8 32.81,9.51 v32.45,9.91 32.15,10.31 32.15,11.46 32.53,11.84 C15.1
  pour VCC (rank 2): -2,26 -2,-2 58,-2 58,26

### Text on the board
tPlace: 3 | PROPBOARD | 2 | 1 | SPKR
bPlace: PROPBOARD
tDocu: + | <- | -> | - | 0 | 1 | 2 | 3 | 4 | 5 | 6 | 7 | 8 | 9 | 10 | 11 | 12 | 3.3V | GND | GND | 5V | SWD | SWD | GND | CLK | IO | 3.3V | BOOT | R1.7 | MADE IN ITALY